# EasyEDA Pro project OhmmeterV1_1.epro

# Schematic Schematic 1

## Sheets
1 Input and Input Protection: Create Date: 2024-03-28; Page Name: Input and Input Protection; Project Name: OhmmeterV1.1_Release; Schematic Name: Schematic 1; Update Date: 2024-03-27; Drawn: Thomas Crisafulli; Page Size: A4
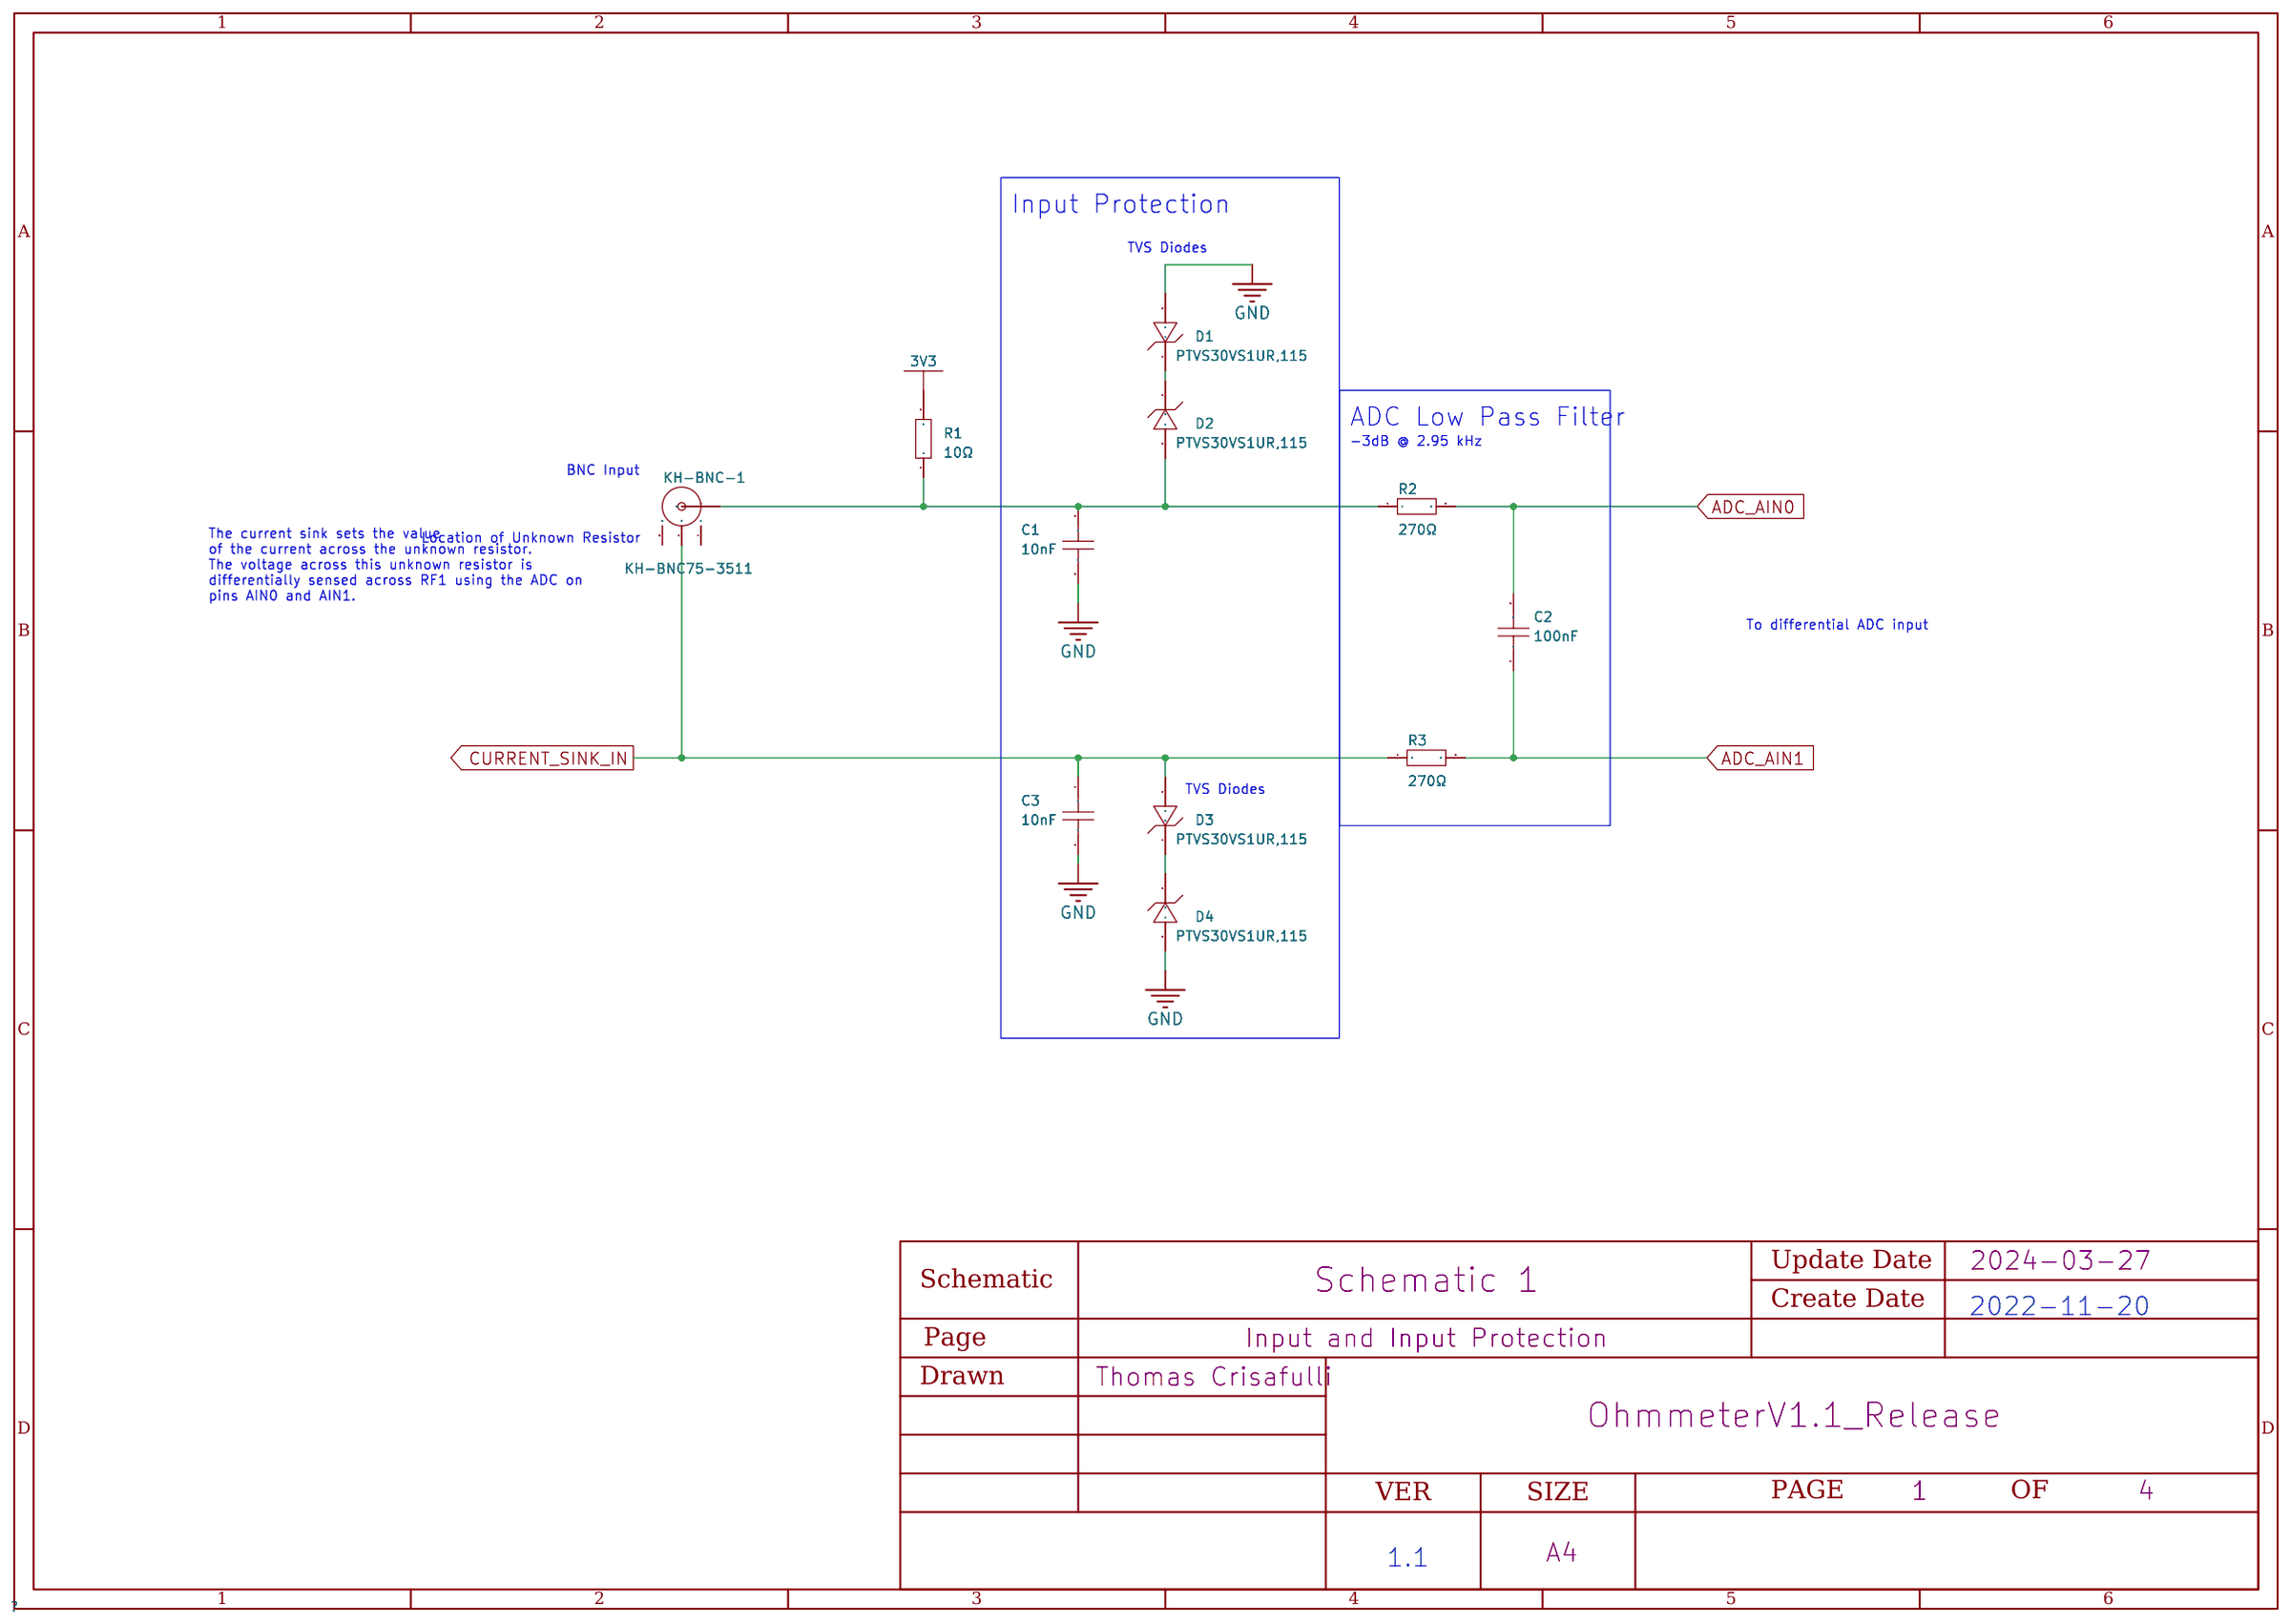
[diagram p0: Input and Input Protection]
2 Digital Circuitry: Page Name: Digital Circuitry; Page Size: A3
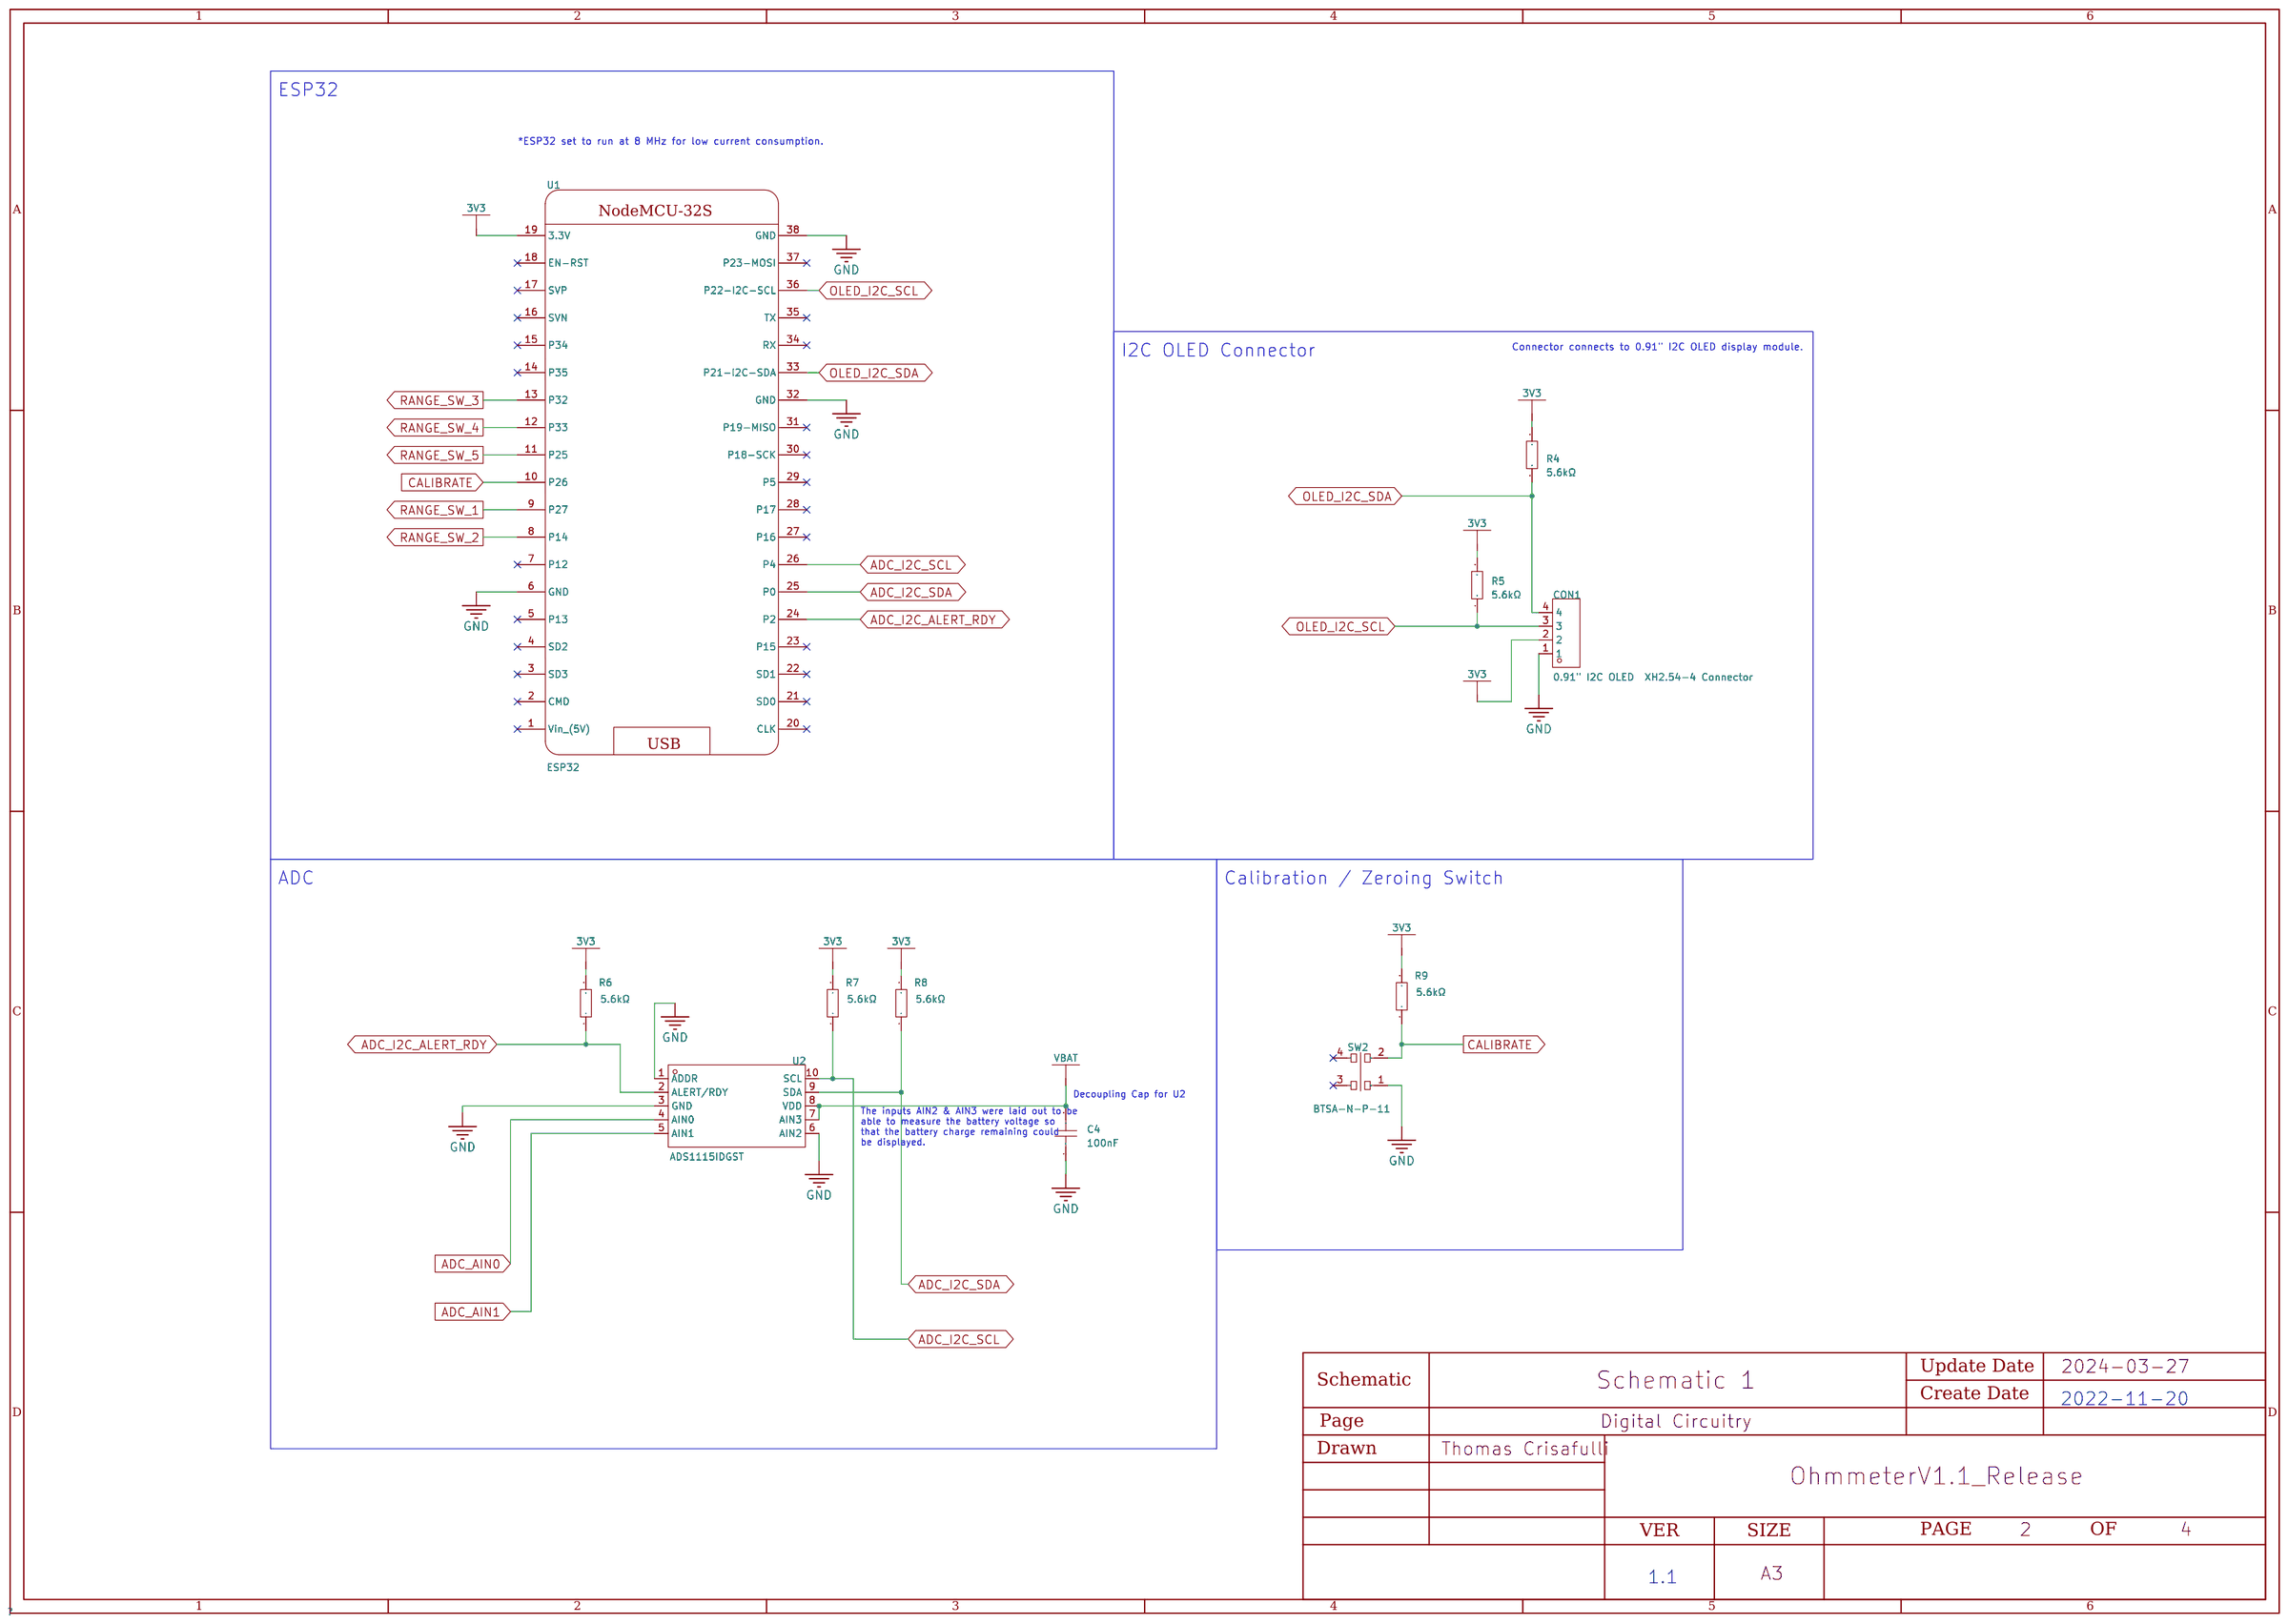
[diagram p1: Digital Circuitry]
3 Current Sink and Ranges: Page Name: Current Sink and Ranges.Schematic 1; Project Name: OhmmeterV3.0_Release; Page Size: A3
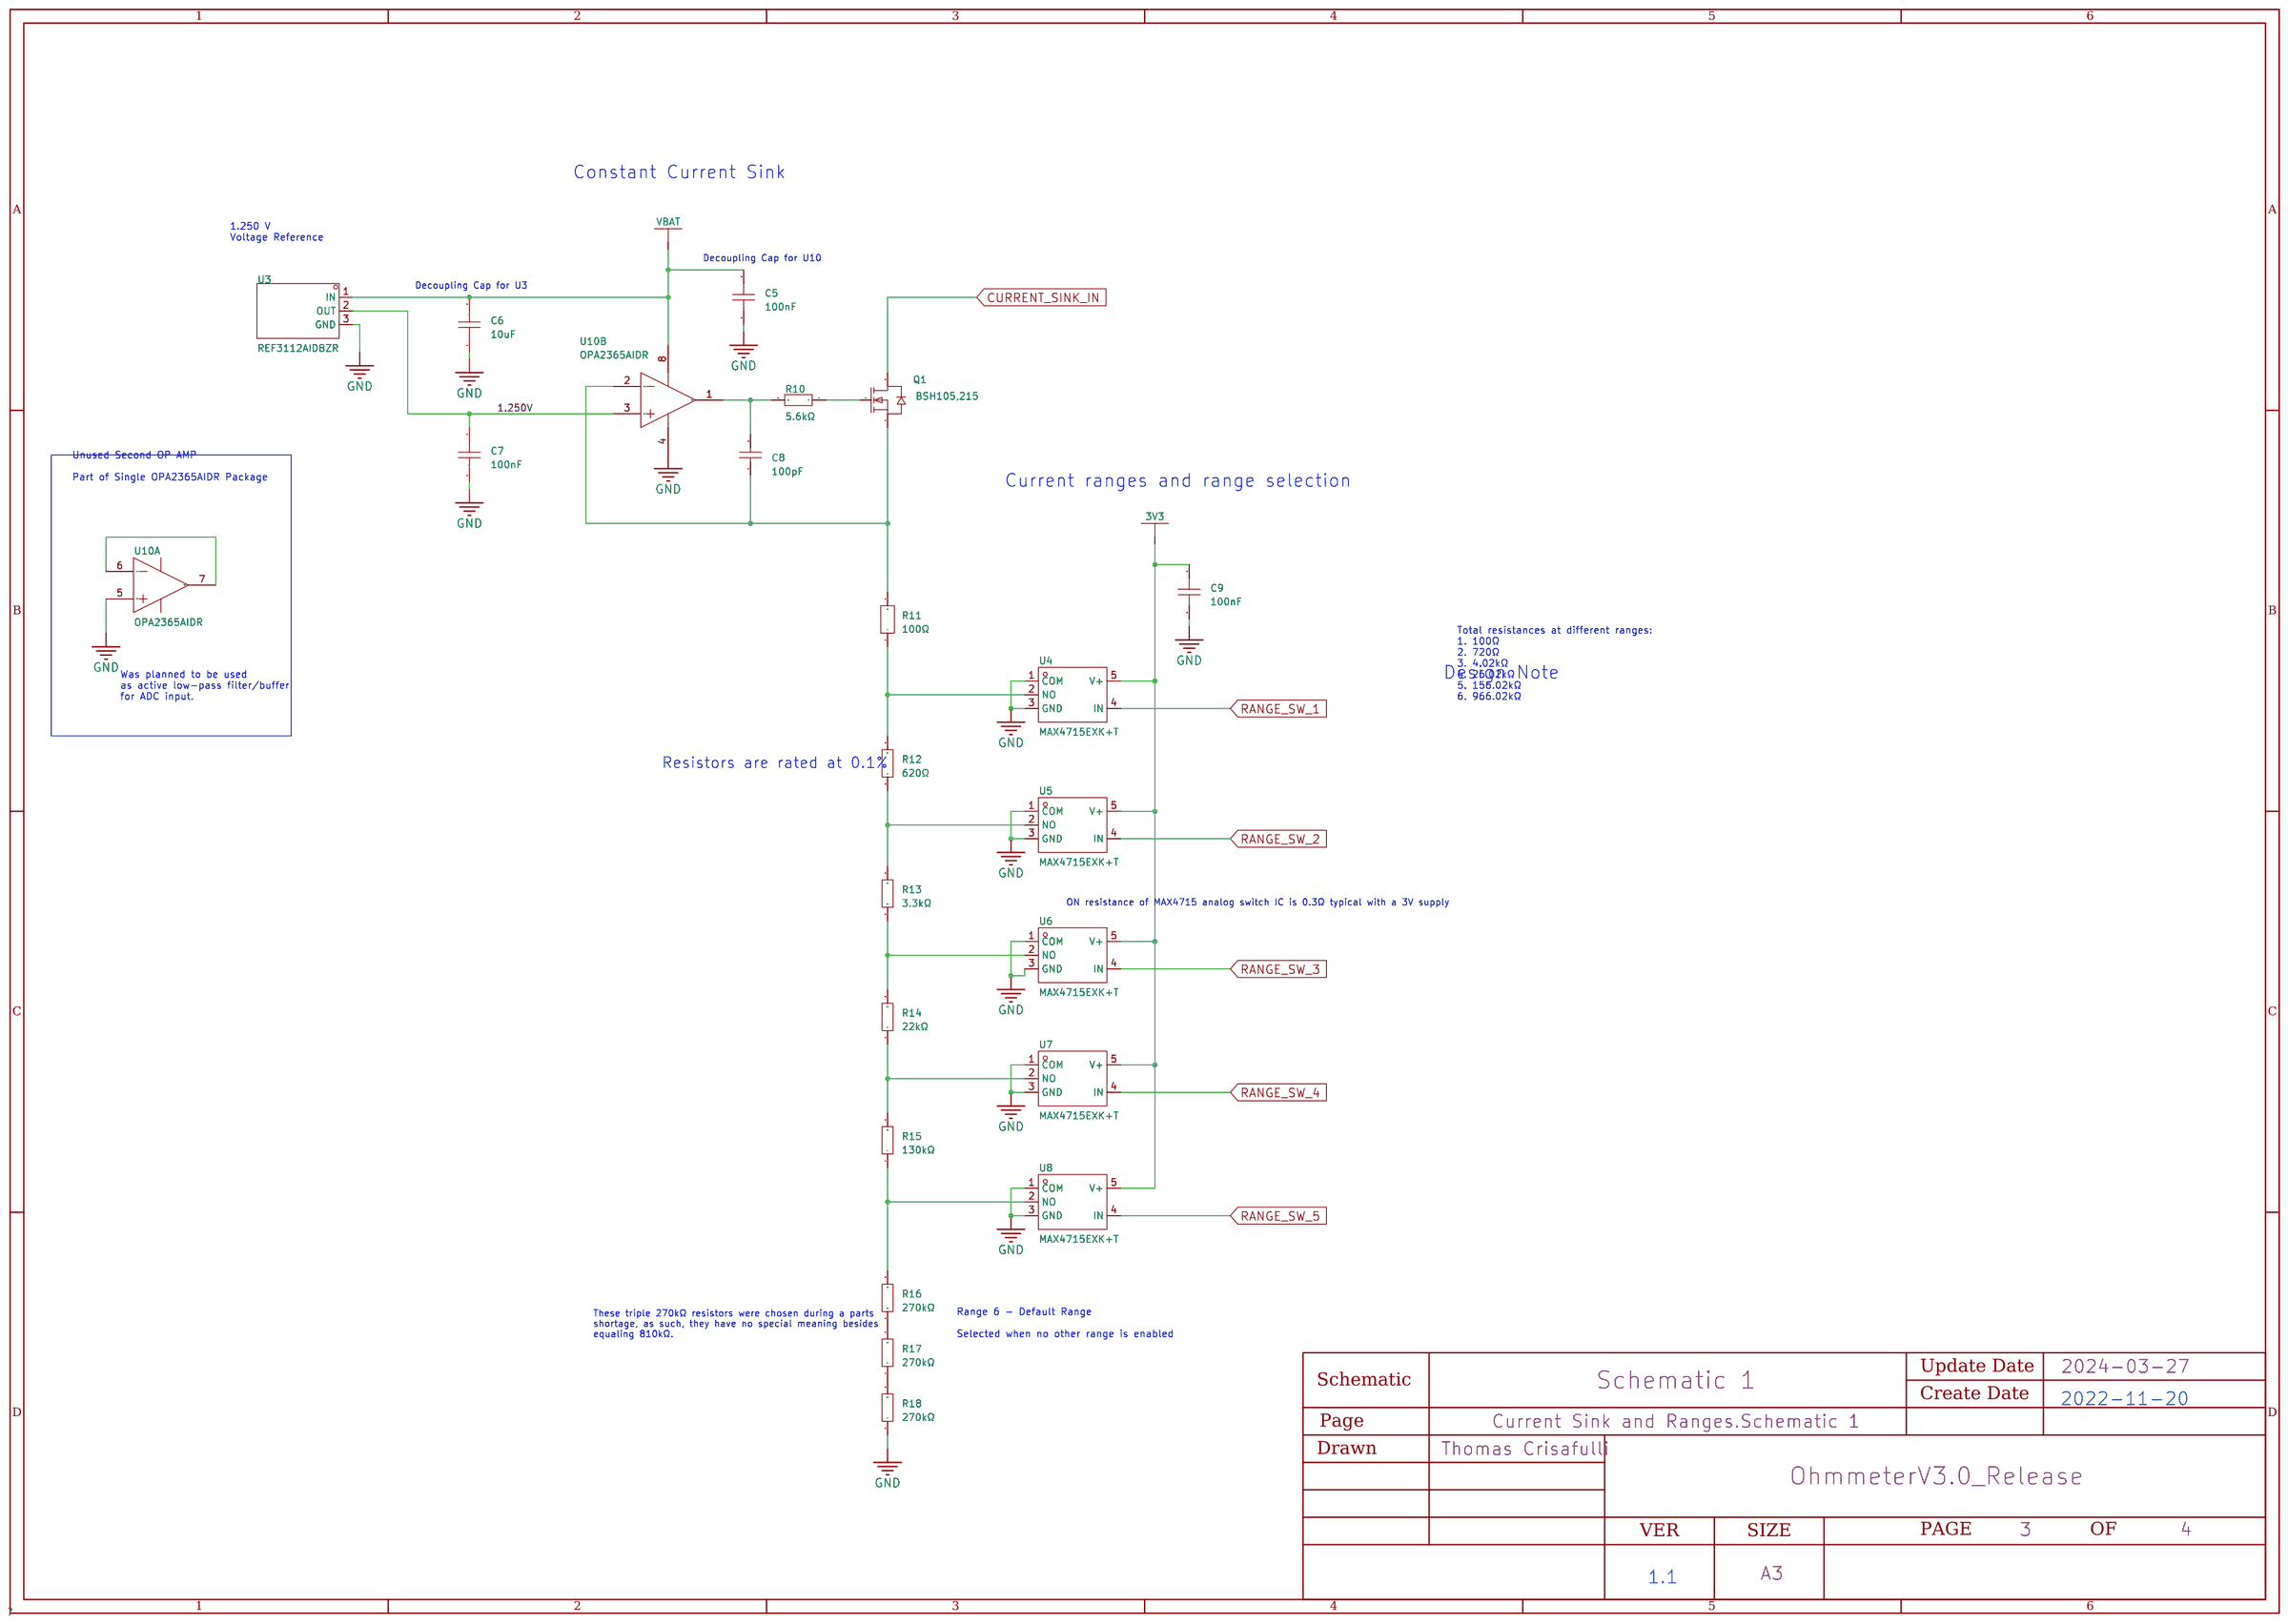
[diagram p2: Current Sink and Ranges]
4 Battery and LDO: Page Name: Battery and LDO; Project Name: OhmmeterV3.0_Release; Schematic Name: schematic
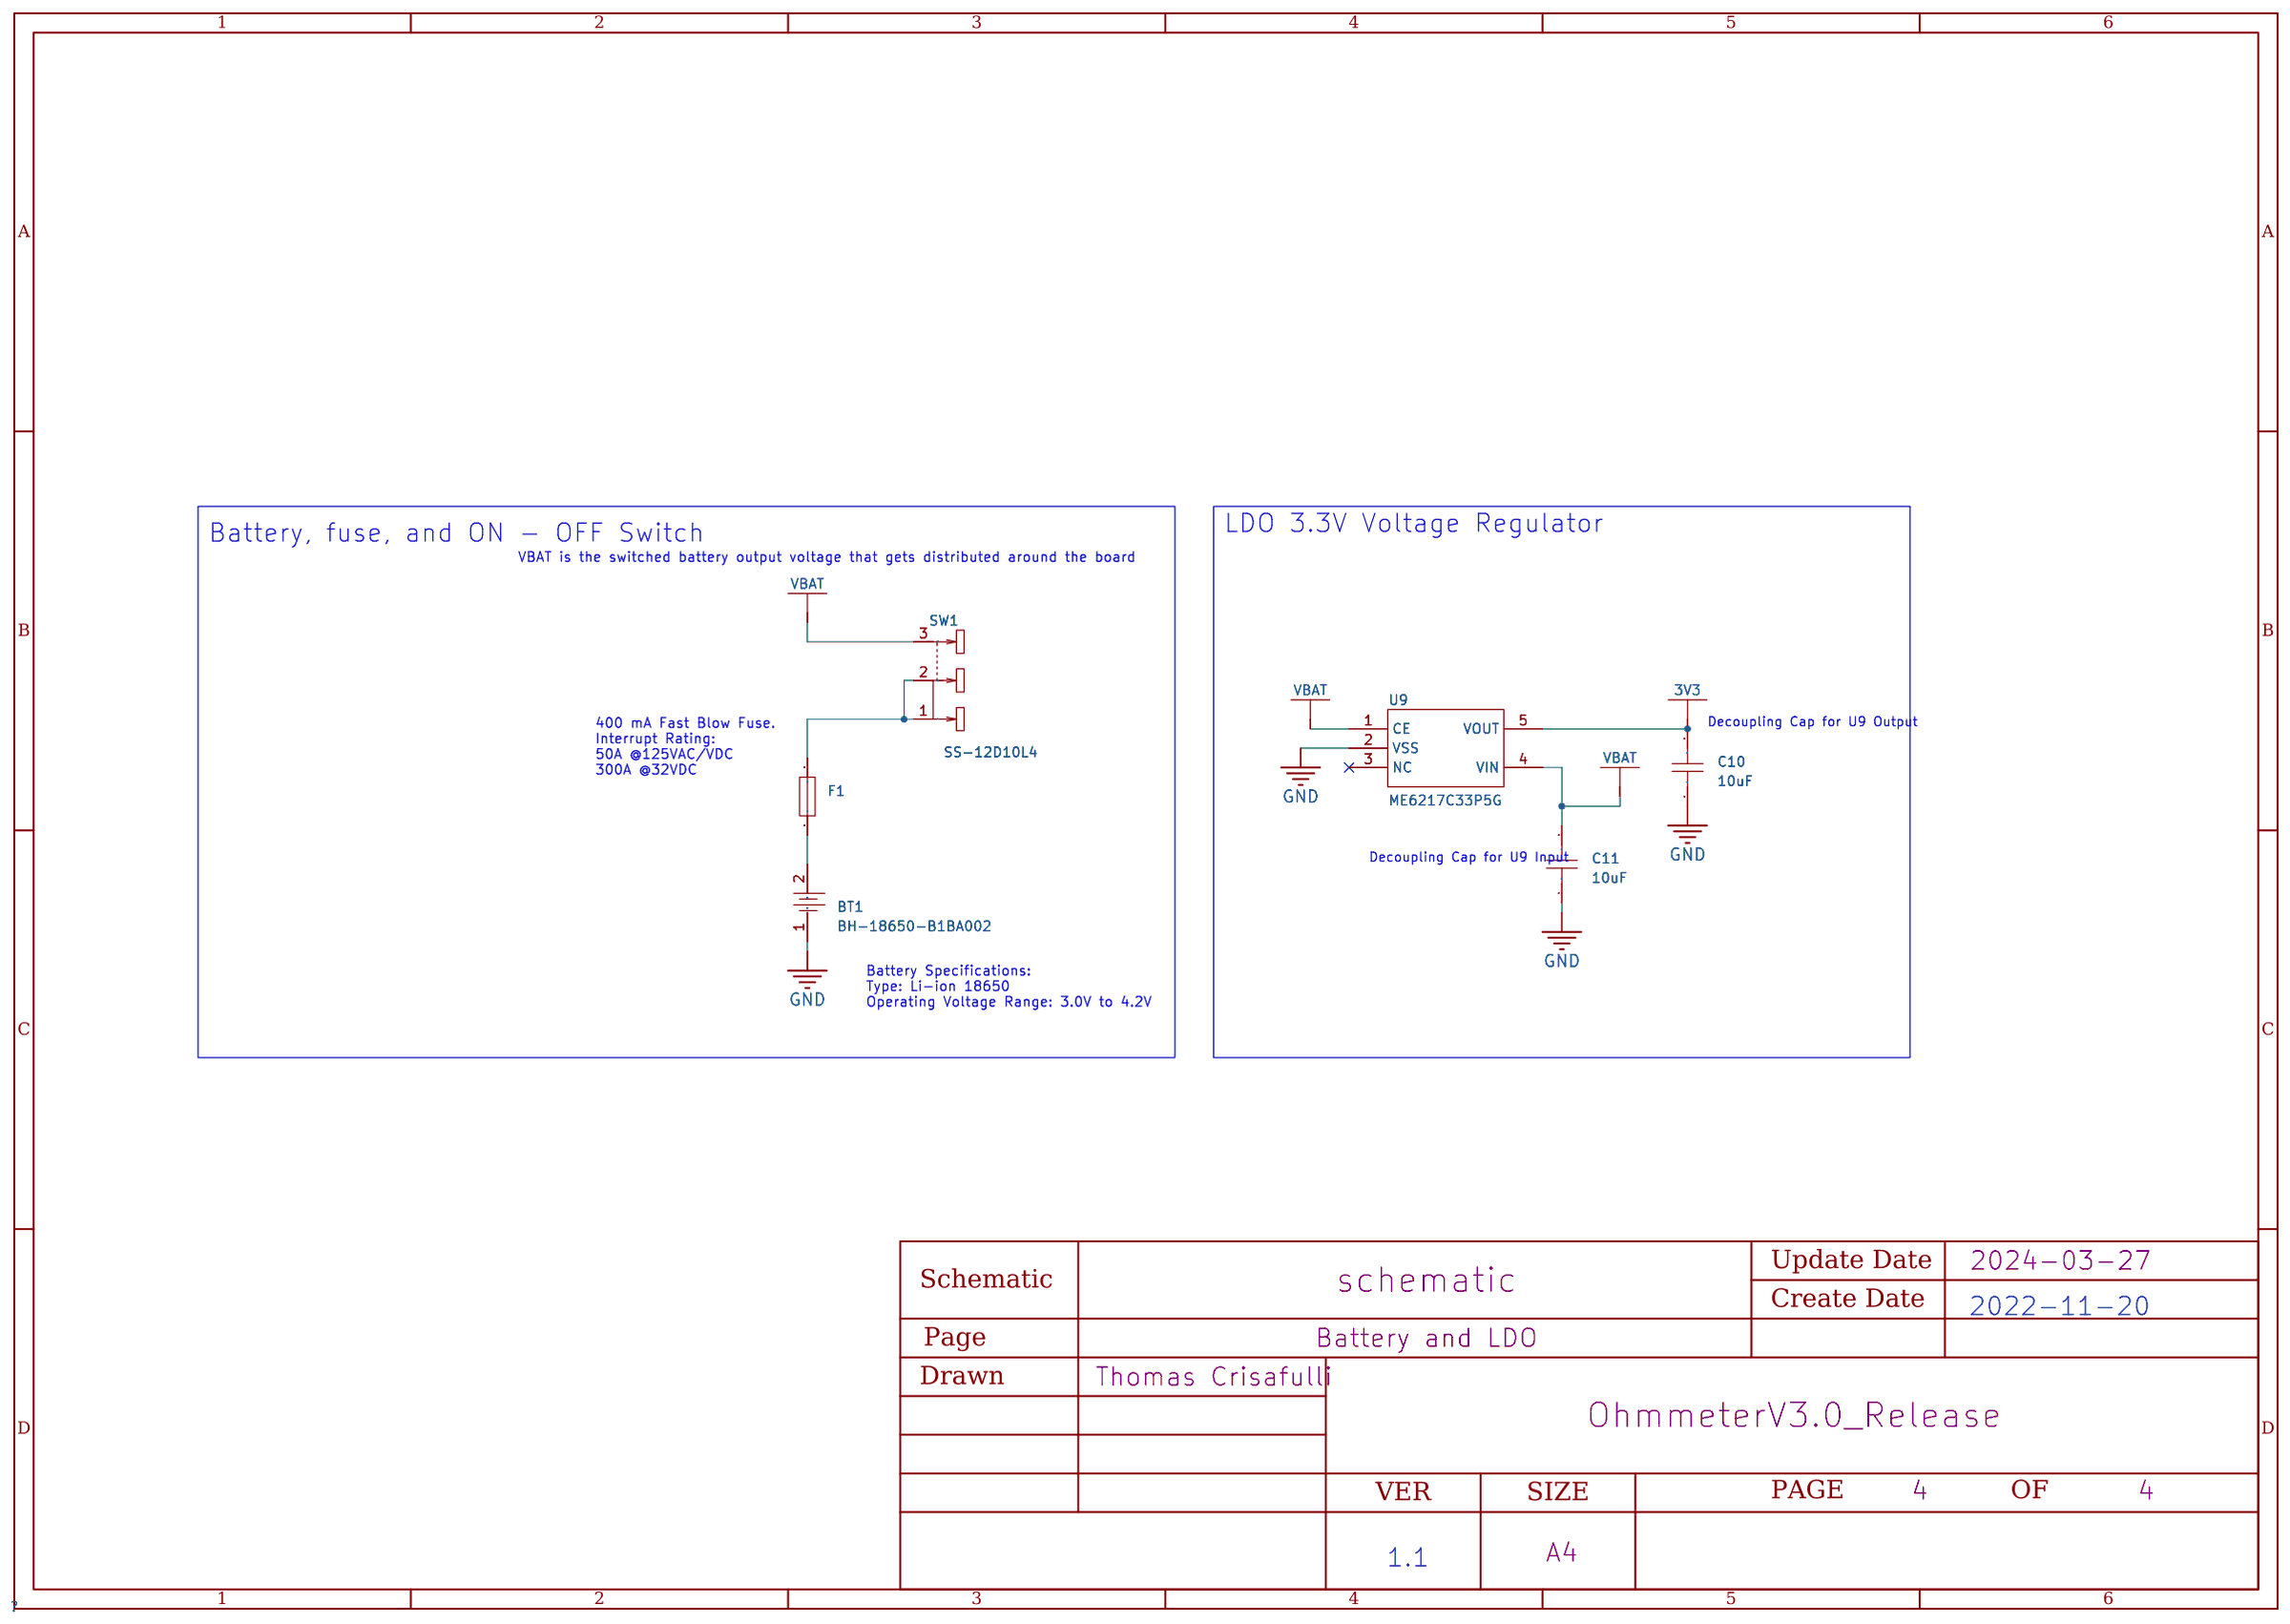
[diagram p3: Battery and LDO]

## Parts
sheet Battery and LDO
BT1  BH-18650-B1BA002  [BATTERY-SMD_18650-1S-L77.1-W20.7-1]
C10  10uF  [C0603]
C11  10uF  [C0603]
F1  -  [0451.400MRL]
SW1  SS-12D10L4  [SW-TH_SS-12D10L3]
U9  ME6217C33P5G  [SOT-89-5_L4.5-W2.5-P1.50-LS4.5-BR]
sheet Current Sink and Ranges
C5  100nF  [C0603]
C6  10uF  [C0603]
C7  100nF  [C0603]
C8  100pF  [C0603]
C9  100nF  [C0603]
Q1  BSH105,215  [TO-236AB_L2.9-W1.3-P0.95-LS2.3-BR]
R10  5.6kΩ  [R0603]
R11  100Ω  [R0805]
R12  620Ω  [R0805]
R13  3.3kΩ  [R0805]
R14  22kΩ  [R0805]
R15  130kΩ  [R0805]
R16  270kΩ  [R0805]
R17  270kΩ  [R0805]
R18  270kΩ  [R0805]
U3  REF3112AIDBZR  [SOT-23-3_L2.9-W1.6-P1.90-LS2.8-BR]
U4  MAX4715EXK+T  [SC-70-5_L2.0-W1.3-P0.65-LS2.1-BR]
U5  MAX4715EXK+T  [SC-70-5_L2.0-W1.3-P0.65-LS2.1-BR]
U6  MAX4715EXK+T  [SC-70-5_L2.0-W1.3-P0.65-LS2.1-BR]
U7  MAX4715EXK+T  [SC-70-5_L2.0-W1.3-P0.65-LS2.1-BR]
U8  MAX4715EXK+T  [SC-70-5_L2.0-W1.3-P0.65-LS2.1-BR]
U10  OPA2365AIDR  [SOIC-8_L4.9-W3.9-P1.27-LS6.0-BL]  (sections 1,2)
sheet Digital Circuitry
C4  100nF  [C0603]
CON1  0.91" I2C OLED  XH2.54-4 Connector  [CONN-TH_XH2.54-4]
R4  5.6kΩ  [R0603]
R5  5.6kΩ  [R0603]
R6  5.6kΩ  [R0603]
R7  5.6kΩ  [R0603]
R8  5.6kΩ  [R0603]
R9  5.6kΩ  [R0603]
SW2  BTSA-N-P-11  [SW-TH_BTSA-X-P-11]
U1  ESP32  [NODEMCU-32SLUA]
U2  ADS1115IDGST  [VSSOP-10_L3.0-W3.0-P0.50-LS4.9-BL]
sheet Input and Input Protection
C1  10nF  [C0603]
C2  100nF  [C0603]
C3  10nF  [C0603]
D1  PTVS30VS1UR,115  [SOD-123_L2.6-W1.7-LS3.5-RD]
D2  PTVS30VS1UR,115  [SOD-123_L2.6-W1.7-LS3.5-RD]
D3  PTVS30VS1UR,115  [SOD-123_L2.6-W1.7-LS3.5-RD]
D4  PTVS30VS1UR,115  [SOD-123_L2.6-W1.7-LS3.5-RD]
KH-BNC-1  KH-BNC75-3511  [ANT-TH_KH-BNC75-3511]
R1  10Ω  [R0603]
R2  270Ω  [R0603]
R3  270Ω  [R0603]

## Library data of the parts
BT1 = BH-18650-B1BA002: LCSC Part Name: 电池盒BH-18650; Supplier Part: C2988620; Manufacturer: MYOUNG(美阳); Supplier Footprint: SMD; JLCPCB Part Class: Extended Part; Datasheet: https://atta.szlcsc.com/upload/public/pdf/source/20220402/870DB99AB50CA0DF8D51CF7C86A51FAB.pdf; Supplier: LCSC
C6 C10 C11 = CL10A106KP8NNNC: Capacitance: Tolerance:±10% Tolerance:±10% Voltage Rated: Temperature Coefficient:; LCSC Part Name: 10uF ±10% 10V; Supplier Part: C19702; Manufacturer: SAMSUNG(三星); Supplier Footprint: 0603; JLCPCB Part Class: Basic Part; Datasheet: https://atta.szlcsc.com/upload/public/pdf/source/20160103/1457707703378.pdf; Supplier: LCSC; Tolerance: ±10%
F1 = 0451.400MRL: 400 mA Fast Blow Fuse. Interrupt Rating: 50A @125VAC/VDC 300A @32VDC
SW1 = SS-12D10L4: Current Rating (DC):3A Voltage Rating (DC):125V Current Rating (AC):3A Voltage Rating (AC):125V Circuit:SPDT Mounting Style:Straight Mechanical Life:10000 Actuator Color:Black Actuator Style:Rectangular columnar Pin Style:PCPin Operating Temperature:-40~; LCSC Part Name: 插件大电流拨动开关 黑色平柄SS-12D10L4; Supplier Part: C843364; Manufacturer: XKB Connectivity(中国星坤); Supplier Footprint: 插件; JLCPCB Part Class: Extended Part; Datasheet: https://atta.szlcsc.com/upload/public/pdf/source/20211009/D6412F37AABE6F9459A6EE7FA4DAEADB.pdf; Supplier: LCSC; Current Rating (DC): 3A; Voltage Rating (DC): 125V; Current Rating (AC): 3A; Voltage Rating (AC): 125V; Circuit: SPDT; Mounting Style: Straight; Mechanical Life: 10000; Actuator Color: Black; Actuator Style: Rectangular columnar; Pin Style: PCPin; Operating Temperature: -40~+85; Switch Length: 13mm; Switch Width: 6.8mm; Switch Height: 6.4mm
U9 = ME6217C33P5G: Output Type: Output Polarity:Positive Number of Outputs:1 Maximum Input Voltage:6.5V Output Voltage:3.3V~3.3V Output Voltage:3.3V~3.3V Dropout Voltage:180mV@(300mA) Output Current:800mA Power Supply Rejection Ratio (PRSS):65dB@(1kHz); LCSC Part Name: Vin=6.5V Vout=3.3V 800mA 65dB@(1kHz); Supplier Part: C81592; Manufacturer: MICRONE(南京微盟); Supplier Footprint: SOT-89-5; JLCPCB Part Class: Extended Part; Datasheet: https://atta.szlcsc.com/upload/public/pdf/source/20170919/C81592_1505787400735977273.pdf; Supplier: LCSC; Output Polarity: Positive; Number of Outputs: 1; Maximum Input Voltage: 6.5V; Output Voltage: 3.3V~3.3V; Dropout Voltage: 180mV@(300mA); Output Current: 800mA; Power Supply Rejection Ratio (PRSS): 65dB@(1kHz)
C2 C4 C5 C7 C9 = CC0603KRX7R9BB104: Capacitance: Tolerance:±10% Tolerance:±10% Voltage Rated: Temperature Coefficient:; LCSC Part Name: 100nF ±10% 50V; Supplier Part: C14663; Manufacturer: YAGEO(国巨); Supplier Footprint: 0603; JLCPCB Part Class: Basic Part; Datasheet: https://atta.szlcsc.com/upload/public/pdf/source/20170116/1484561234239.pdf; Supplier: LCSC; Tolerance: ±10%
C8 = 0603CG101F500NT: Capacitance: Tolerance:±1% Tolerance:±1% Voltage Rated: Temperature Coefficient:; LCSC Part Name: 100pF ±1% 50V; Supplier Part: C55722; Manufacturer: FH(风华); Supplier Footprint: 0603; JLCPCB Part Class: Extended Part; Datasheet: https://atta.szlcsc.com/upload/public/pdf/source/20170923/C55722_1506149491504988838.pdf; Supplier: LCSC; Tolerance: ±1%
Q1 = BSH105,215: Type: Drain Source Voltage (Vdss): Continuous Drain Current (Id): Power Dissipation (Pd): Drain Source On Resistance (RDS(on)@Vgs,Id):200mΩ@4.5V,600mA Gate Threshold Voltage (Vgs(th)@Id):570mV@1mA; LCSC Part Name: N沟道 20V 1.05A; Supplier Part: C478010; Manufacturer: Nexperia(安世); Supplier Footprint: TO-236AB; JLCPCB Part Class: Extended Part; Datasheet: https://atta.szlcsc.com/upload/public/pdf/source/20200102/C478010_E6AC30BA7E41EA0C1C4E682856045296.pdf; Supplier: LCSC; Drain Source On Resistance (RDS(on)@Vgs,Id): 200mΩ@4.5V,600mA; Gate Threshold Voltage (Vgs(th)@Id): 570mV@1mA
R4-R10 = RMC06035.6K1%N: Resistance:5.6kΩ Tolerance:±1% Power(Watts):0.1W; LCSC Part Name: 5.6KΩ ±1%; Supplier Part: C325717; Manufacturer: Tyohm(幸亚电阻); Supplier Footprint: 0603; JLCPCB Part Class: Extended Part; Datasheet: https://atta.szlcsc.com/upload/public/pdf/source/20190115/C325717_00CC223FA0A7351D36013C012E297DA3.pdf; Supplier: LCSC; Tolerance: ±1%; Power(Watts): 0.1W
R11 = RT0805BRB07100RL: Type:Thin Film Resistor Resistance: Tolerance:±0.1% Tolerance:±0.1% Power(Watts): Temperature Coefficient:±10ppm/ Temperature Coefficient:±10ppm/ Overload Voltage (Max): Operating Temperature Range:-55~+155 Operating Temperature Range:-55~+155; LCSC Part Name: 100Ω ±0.1% 125mW; Supplier Part: C706199; Manufacturer: YAGEO(国巨); Supplier Footprint: 0805; JLCPCB Part Class: Extended Part; Datasheet: https://atta.szlcsc.com/upload/public/pdf/source/20200720/C706199_F8B0308A35FC487A6D0BBE73ED768472.pdf; Supplier: LCSC; Type: Thin Film Resistor; Tolerance: ±0.1%; Temperature Coefficient: ±10ppm/; Operating Temperature Range: -55~+155
R12 = PTFR0805B620RN9: Type:Thin Film Resistor Resistance: Tolerance:±0.1% Tolerance:±0.1% Power(Watts): Temperature Coefficient:±10ppm/ Temperature Coefficient:±10ppm/ Overload Voltage (Max): Operating Temperature Range:-55~+125 Operating Temperature Range:-55~+125; LCSC Part Name: 620Ω ±0.1% 130mW; Supplier Part: C351557; Manufacturer: RESI(开步睿思）; Supplier Footprint: 0805; JLCPCB Part Class: Extended Part; Datasheet: https://atta.szlcsc.com/upload/public/pdf/source/20200421/C328426_1F8A6F869BB4A34F9E140D3E05CCCC70.pdf; Supplier: LCSC; Type: Thin Film Resistor; Tolerance: ±0.1%; Temperature Coefficient: ±10ppm/; Operating Temperature Range: -55~+125
R13 = PTFR0805B3K30N9: Type:Thin Film Resistor Resistance: Tolerance:±0.1% Tolerance:±0.1% Power(Watts): Temperature Coefficient:±10ppm/ Temperature Coefficient:±10ppm/ Overload Voltage (Max): Operating Temperature Range:-55~+125 Operating Temperature Range:-55~+125; LCSC Part Name: 3.3kΩ ±0.1% 130mW; Supplier Part: C351569; Manufacturer: RESI(开步睿思）; Supplier Footprint: 0805; JLCPCB Part Class: Extended Part; Datasheet: https://atta.szlcsc.com/upload/public/pdf/source/20200421/C328426_1F8A6F869BB4A34F9E140D3E05CCCC70.pdf; Supplier: LCSC; Type: Thin Film Resistor; Tolerance: ±0.1%; Temperature Coefficient: ±10ppm/; Operating Temperature Range: -55~+125
R14 = PTFR0805B22K0N9: Type:Thin Film Resistor Resistance: Tolerance:±0.1% Tolerance:±0.1% Power(Watts): Temperature Coefficient:±10ppm/ Temperature Coefficient:±10ppm/ Overload Voltage (Max): Operating Temperature Range:-55~+125 Operating Temperature Range:-55~+125; LCSC Part Name: 22kΩ ±0.1% 130mW; Supplier Part: C351592; Manufacturer: RESI(开步睿思）; Supplier Footprint: 0805; JLCPCB Part Class: Extended Part; Datasheet: https://atta.szlcsc.com/upload/public/pdf/source/20200421/C328426_1F8A6F869BB4A34F9E140D3E05CCCC70.pdf; Supplier: LCSC; Type: Thin Film Resistor; Tolerance: ±0.1%; Temperature Coefficient: ±10ppm/; Operating Temperature Range: -55~+125
R15 = PTFR0805B130KN9: Type:Thin Film Resistor Resistance: Tolerance:±0.1% Tolerance:±0.1% Power(Watts): Temperature Coefficient:±10ppm/ Temperature Coefficient:±10ppm/ Overload Voltage (Max): Operating Temperature Range:-55~+125 Operating Temperature Range:-55~+125; LCSC Part Name: 130kΩ ±0.1% 130mW; Supplier Part: C351613; Manufacturer: RESI(开步睿思）; Supplier Footprint: 0805; JLCPCB Part Class: Extended Part; Datasheet: https://atta.szlcsc.com/upload/public/pdf/source/20200421/C328426_1F8A6F869BB4A34F9E140D3E05CCCC70.pdf; Supplier: LCSC; Type: Thin Film Resistor; Tolerance: ±0.1%; Temperature Coefficient: ±10ppm/; Operating Temperature Range: -55~+125
R16-R18 = PTFR0805B270KN9: Type:Thin Film Resistor Resistance: Tolerance:±0.1% Tolerance:±0.1% Power(Watts): Temperature Coefficient:±10ppm/ Temperature Coefficient:±10ppm/ Overload Voltage (Max): Operating Temperature Range:-55~+125 Operating Temperature Range:-55~+125; LCSC Part Name: 270kΩ ±0.1% 130mW; Supplier Part: C351588; Manufacturer: RESI(开步睿思）; Supplier Footprint: 0805; JLCPCB Part Class: Extended Part; Datasheet: https://atta.szlcsc.com/upload/public/pdf/source/20200421/C328426_1F8A6F869BB4A34F9E140D3E05CCCC70.pdf; Supplier: LCSC; Type: Thin Film Resistor; Tolerance: ±0.1%; Temperature Coefficient: ±10ppm/; Operating Temperature Range: -55~+125
U3 = REF3112AIDBZR: Reference Type:series connection Output Type:Fixed Input Voltage:1.8V~5.5V Input Voltage:1.8V~5.5V Output Current:10mA Tolerance:±0.2% Tolerance:±0.2% Temperature Coefficient:20ppm/ Supply Current:135uA Noise - 1/10Hz to 10Hz:17uVp-p Noise - 10Hz to 10kH; LCSC Part Name: 串联 10mA; Supplier Part: C74223; Manufacturer: TI(德州仪器); Supplier Footprint: SOT-23(SOT-23-3); JLCPCB Part Class: Extended Part; Datasheet: https://atta.szlcsc.com/upload/public/pdf/source/20180326/C74223_A49D4B7B40A1FCF0C88241B13A13CC28.pdf; Supplier: LCSC; Reference Type: series connection; Output Type: Fixed; Input Voltage: 1.8V~5.5V; Output Current: 10mA; Tolerance: ±0.2%; Temperature Coefficient: 20ppm/; Supply Current: 135uA; Noise - 1/10Hz to 10Hz: 17uVp-p; Noise - 10Hz to 10kHz: 24uVrms; Operating Temperature: -40~+125@(Ta)
U4-U8 = MAX4715EXK+T: Switch Circuit:- Multiplexer/Demultiplexer Circuit:- Number of Circuits:- On Resistance (Max):- Switch Voltage (Max):- On Time (Max):- Off Time (Max):- Supply Voltage:- Operating Temperature:-; Supplier Part: C2651930; Manufacturer: MAXIM(美信); Supplier Footprint: SC-70-5; JLCPCB Part Class: Extended Part; Datasheet: https://atta.szlcsc.comnull; Supplier: LCSC
U10 = OPA2365AIDR: Amplifier Type:High-speedbroadbandamplifier Number of Circuits: -3db Bandwidth（G=1）:- Current - Input Bias（Ib）:0.2pA Voltage - Input Offset（Vos）:100uV Gain Bandwidth Product（GBP）: Slew Rate（SR）: Output Type:Rail-to-Rail Supply Voltage（Single）: Iq per chan; Supplier Part: C130011; Manufacturer: TI(德州仪器); Supplier Footprint: SOIC-8_150mil; JLCPCB Part Class: Extended Part; Datasheet: https://atta.szlcsc.com/upload/public/pdf/source/20170918/C130011_1505703251368975095.pdf; Supplier: LCSC; Amplifier Type: High-speedbroadbandamplifier; Current - Input Bias（Ib）: 0.2pA; Voltage - Input Offset（Vos）: 100uV; Output Type: Rail-to-Rail
CON1 = XH2.54-4_C9900012082: LCSC Part Name: XH2.54-4; Supplier Part: C9900012082; Supplier Footprint: Header4; JLCPCB Part Class: Extended Part; Datasheet: https://atta.szlcsc.comnull; Supplier: LCSC
SW2 = BTSA-N-P-11: Contact Current:100mA Voltage Rating (AC):- Voltage Rating (DC):- Insulation Resistance:100MΩ Circuit:- Mounting Style:Straight Self Lock / No Lock:No lock Actuator Style:Square Plunger Actuator/Cap Color:Blue With Lamp:No Pin Style:PCPin Operating Force:; Supplier Part: C2888323; Manufacturer: ROCPU Switches(台普); Supplier Footprint: 插件; JLCPCB Part Class: Extended Part; Datasheet: https://atta.szlcsc.com/upload/public/pdf/source/20210914/4FB41C6B2F934BE864C4B13707F31A70.pdf; Supplier: LCSC; Contact Current: 100mA; Insulation Resistance: 100MΩ; Mounting Style: Straight; Self Lock / No Lock: No lock; Actuator Style: Square Plunger; Actuator/Cap Color: Blue; With Lamp: No; Pin Style: PCPin; Operating Force: 250gf@±50gf; Operating Temperature: -20~+70; Mechanical Life: 10000
U1 = ESP32: Supplier: LCSC; Supplier Part: C111436; Manufacturer: Ai-Thinker; Manufacturer Part: NodeMCU-32SLua; link: https://lcsc.com/product-detail/Modules_NodeMCU-32S-Lua_C111436.html
U2 = ADS1115IDGST: Number of Bits:- Sampling Rate (Per Second): Number of Inputs: Input Type: Data Interface: Voltage - Supply: Reference Type:; Supplier Part: C468683; Manufacturer: TI(德州仪器); Supplier Footprint: VSSOP-10; JLCPCB Part Class: Extended Part; Datasheet: https://atta.szlcsc.com/upload/public/pdf/source/20200108/C468683_F8EABDE88EC9D3B6CCD5339FC0AB3BAE.pdf; Supplier: LCSC
C1 C3 = 06031C103K4T2A: Capacitance: Tolerance:±10% Tolerance:±10% Voltage Rated: Temperature Coefficient:; LCSC Part Name: 10nF ±10% 100V; Supplier Part: C597087; Manufacturer: Kyocera AVX; Supplier Footprint: 0603; JLCPCB Part Class: Extended Part; Datasheet: https://atta.szlcsc.com/upload/public/pdf/source/20200611/C596996_5C2870FCBE04273D0B42880C13DA8C38.pdf; Supplier: LCSC; Tolerance: ±10%
D1-D4 = PTVS30VS1UR,115: Polarity:- Reverse Stand-Off Voltage (Vrwm):30V Breakdown Voltage (Min):33.3V Breakdown Voltage (Max):36.8V Reverse Leakage Current (Ir):0.1uA Peak Pulse Current (Ipp)@10/1000s:- Maximum Clamping Voltage:48.4V Peak Pulse Power Dissipation (Ppp)@10/1000s; LCSC Part Name: Vrwm:30V 400W; Supplier Part: C553410; Manufacturer: Nexperia(安世); Supplier Footprint: SOD-123W; JLCPCB Part Class: Extended Part; Datasheet: https://atta.szlcsc.com/upload/public/pdf/source/20200102/C478011_F05D9968189F983388C839BB3EF367D6.pdf; Supplier: LCSC; Reverse Stand-Off Voltage (Vrwm): 30V; Breakdown Voltage (Min): 33.3V; Breakdown Voltage (Max): 36.8V; Reverse Leakage Current (Ir): 0.1uA; Maximum Clamping Voltage: 48.4V; Peak Pulse Power Dissipation (Ppp)@10/1000μs: 400W
KH-BNC-1 = KH-BNC75-3511: Connector Type:板端 RF Series:BNC Interface Type:内孔 Number of Ports:1 Impedance:75Ω Frequency-Max:3GHz Style:弯头 Interface Diameter:9.5mm Interface Length/Height:- Operating Temperature Range:-55~+155 Operating Temperature Range:-55~+155; LCSC Part Name: BNC 内孔 弯头; Supplier Part: C2837588; Manufacturer: kinghelm(金航标); Supplier Footprint: 插件; JLCPCB Part Class: Extended Part; Datasheet: https://atta.szlcsc.com/upload/public/pdf/source/20221123/107886A8942993FCB0C00E519661A2AA.pdf; Supplier: LCSC; Connector Type: 板端; RF Series: BNC; Interface Type: 内孔; Number of Ports: 1; Impedance: 75Ω; Frequency-Max: 3GHz; Style: 弯头; Interface Diameter: 9.5mm; Operating Temperature Range: -55~+155
R1 = AC0603FR-0710RL: Type:Thick Film Resistors Resistance: Tolerance:±1% Tolerance:±1% Power(Watts): Overload Voltage (Max): Temperature Coefficient:±200ppm/℃ Temperature Coefficient:±200ppm/℃ Operating Temperature Range:-55℃~+155℃ Operating Temperature Range:-55℃~+155℃; LCSC Part Name: 厚膜电阻 10Ω ±1% 100mW; Supplier Part: C138286; Manufacturer: YAGEO(国巨); Supplier Footprint: 0603; JLCPCB Part Class: Extended Part; Datasheet: https://atta.szlcsc.com/upload/public/pdf/source/20180927/C229861_4ABDC471507C1ED6AFB4BA66AFC8620A.pdf; Supplier: LCSC; Type: Thick Film Resistors; Tolerance: ±1%; Temperature Coefficient: ±200ppm/℃; Operating Temperature Range: -55℃~+155℃
R2 R3 = RS-03K2700FT: Resistance: Tolerance:±1% Tolerance:±1% Power(Watts): Temperature Coefficient:±100ppm/ Temperature Coefficient:±100ppm/ Overload Voltage (Max): Operating Temperature Range:-55~+155 Operating Temperature Range:-55~+155; LCSC Part Name: 270Ω ±1% 100mW; Supplier Part: C286581; Manufacturer: FH(风华); Supplier Footprint: 0603; JLCPCB Part Class: Extended Part; Datasheet: https://atta.szlcsc.com/upload/public/pdf/source/20180927/C286581_BEC7BD5AD7941FF51850C451D7F33E21.pdf; Supplier: LCSC; Tolerance: ±1%; Temperature Coefficient: ±100ppm/; Operating Temperature Range: -55~+155

## Nets
1.250V: C7.1 U3.2(OUT) U10.3(IN A+)
3V3: C9.2 C10.2 CON1.2 R1.2 R4.1 R5.2 R6.2 R7.2 R8.2 R9.2 U1.19(3.3V) U4.5(V+) U5.5(V+) U6.5(V+) U7.5(V+) U8.5(V+) U9.5(VOUT)
GND: BT1.1 C1.2 C3.2 C4.1 C5.1 C6.1 C7.2 C9.1 C10.1 C11.1 CON1.1 D1.2(A) D4.2(A) R18.1 SW2.1 U1.6(GND) U1.32(GND) U1.38(GND) U2.1(ADDR) U2.3(GND) U2.6(AIN2) U3.3(GND) U4.1(COM) U4.3(GND) U5.1(COM) U5.3(GND) U6.1(COM) U6.3(GND) U7.1(COM) U7.3(GND) U8.1(COM) U8.3(GND) U9.2(VSS) U10.4(V-) U10.5(IN B+)
VBAT: C4.2 C5.2 C6.2 C11.2 SW1.3 U2.7(AIN3) U2.8(VDD) U3.1(IN) U9.1(CE) U9.4(VIN) U10.8(V+)
ADC_AIN0: C2.2 R2.2 U2.4(AIN0)
ADC_AIN1: C2.1 R3.2 U2.5(AIN1)
ADC_I2C_ALERT_RDY: R6.1 U1.24(P2) U2.2(ALERT/RDY)
ADC_I2C_SCL: R7.1 U1.26(P4) U2.10(SCL)
ADC_I2C_SDA: R8.1 U1.25(P0) U2.9(SDA)
CALIBRATE: R9.1 SW2.2 U1.10(P26)
CURRENT_SINK_IN: C3.1 D3.2(A) KH-BNC-1.2 Q1.3(D) R3.1
OLED_I2C_SCL: CON1.3 R5.1 U1.36(P22-I2C-SCL)
OLED_I2C_SDA: CON1.4 R4.2 U1.33(P21-I2C-SDA)
RANGE_SW_1: U1.9(P27) U4.4(IN)
RANGE_SW_2: U1.8(P14) U5.4(IN)
RANGE_SW_3: U1.13(P32) U6.4(IN)
RANGE_SW_4: U1.12(P33) U7.4(IN)
RANGE_SW_5: U1.11(P25) U8.4(IN)
$1N34949: D1.1(C) D2.1(C)
$1N40044: D3.1(C) D4.1(C)
$1N64285: C1.1 D2.2(A) KH-BNC-1.1(OUT) R1.1 R2.1
$4N526: Q1.1(G) R10.1
$4N529: C8.1 R10.2 U10.1(VOUT A)
$4N533: U10.6(IN B-) U10.7(VOUT B)
$4N538: C8.2 Q1.2(S) R11.2 U10.2(IN A-)
$4N2969: R16.1 R17.2
$4N2970: R17.1 R18.2
$4N2972: R15.1 R16.2 U8.2(NO)
$4N2973: R13.1 R14.2 U6.2(NO)
$4N2979: R14.1 R15.2 U7.2(NO)
$4N2983: R12.1 R13.2 U5.2(NO)
$4N3047: R11.1 R12.2 U4.2(NO)
$6N1642: BT1.2 F1.1
$6N1643: F1.2 SW1.1 SW1.2

Not connected (* = marked no-connect by the designer): KH-BNC-1 3 4; SW2 3* 4*; U1 1(Vin (5V))* 2(CMD)* 3(SD3)* 4(SD2)* 5(P13)* 7(P12)* 14(P35)* 15(P34)* 16(SVN)* 17(SVP)* 18(EN-RST)* 20(CLK)* 21(SD0)* 22(SD1)* 23(P15)* 27(P16)* 28(P17)* 29(P5)* 30(P18-SCK)* 31(P19-MISO)* 34(RX)* 35(TX)* 37(P23-MOSI)*; U9 3(NC)*

## Notes on the sheets
sheet 1
- Input Protection
- TVS Diodes
- ADC Low Pass Filter
- -3dB @ 2.95 kHz
- BNC Input
- Location of Unknown Resistor
- The current sink sets the value
  of the current across the unknown resistor.
  The voltage across this unknown resistor is
  differentially sensed across RF1 using the ADC on
  pins AIN0 and AIN1.
- To differential ADC input
- TVS Diodes
sheet 2
- ESP32
- *ESP32 set to run at 8 MHz for low current consumption.
- Connector connects to 0.91" I2C OLED display module.
- I2C OLED Connector
- ADC
- Calibration / Zeroing Switch
- Decoupling Cap for U2
- The inputs AIN2 & AIN3 were laid out to be
  able to measure the battery voltage so
  that the battery charge remaining could
  be displayed.
sheet 3
- Constant Current Sink
- 1.250 V
  Voltage Reference
- Decoupling Cap for U10
- Decoupling Cap for U3
- Unused Second OP AMP
  Part of Single OPA2365AIDR Package
- Current ranges and range selection
- Design Note
- Was planned to be used
  as active low-pass filter/buffer
  for ADC input.
- Total resistances at different ranges:
  1. 100Ω
  2. 720Ω
  3. 4.02kΩ
  4. 26.02kΩ
  5. 156.02kΩ
  6. 966.02kΩ
- Resistors are rated at 0.1%
- ON resistance of MAX4715 analog switch IC is 0.3Ω typical with a 3V supply
- These triple 270kΩ resistors were chosen during a parts
  shortage, as such, they have no special meaning besides
  equaling 810kΩ.
- Range 6 - Default Range
  Selected when no other range is enabled
sheet 4
- Battery, fuse, and ON - OFF Switch
- LDO 3.3V Voltage Regulator
- VBAT is the switched battery output voltage that gets distributed around the board
- Decoupling Cap for U9 Output
- 400 mA Fast Blow Fuse.
  Interrupt Rating:
  50A @125VAC/VDC
  300A @32VDC
- Decoupling Cap for U9 Input
- Battery Specifications:
  Type: Li-ion 18650
  Operating Voltage Range: 3.0V to 4.2V

# Board PCB1
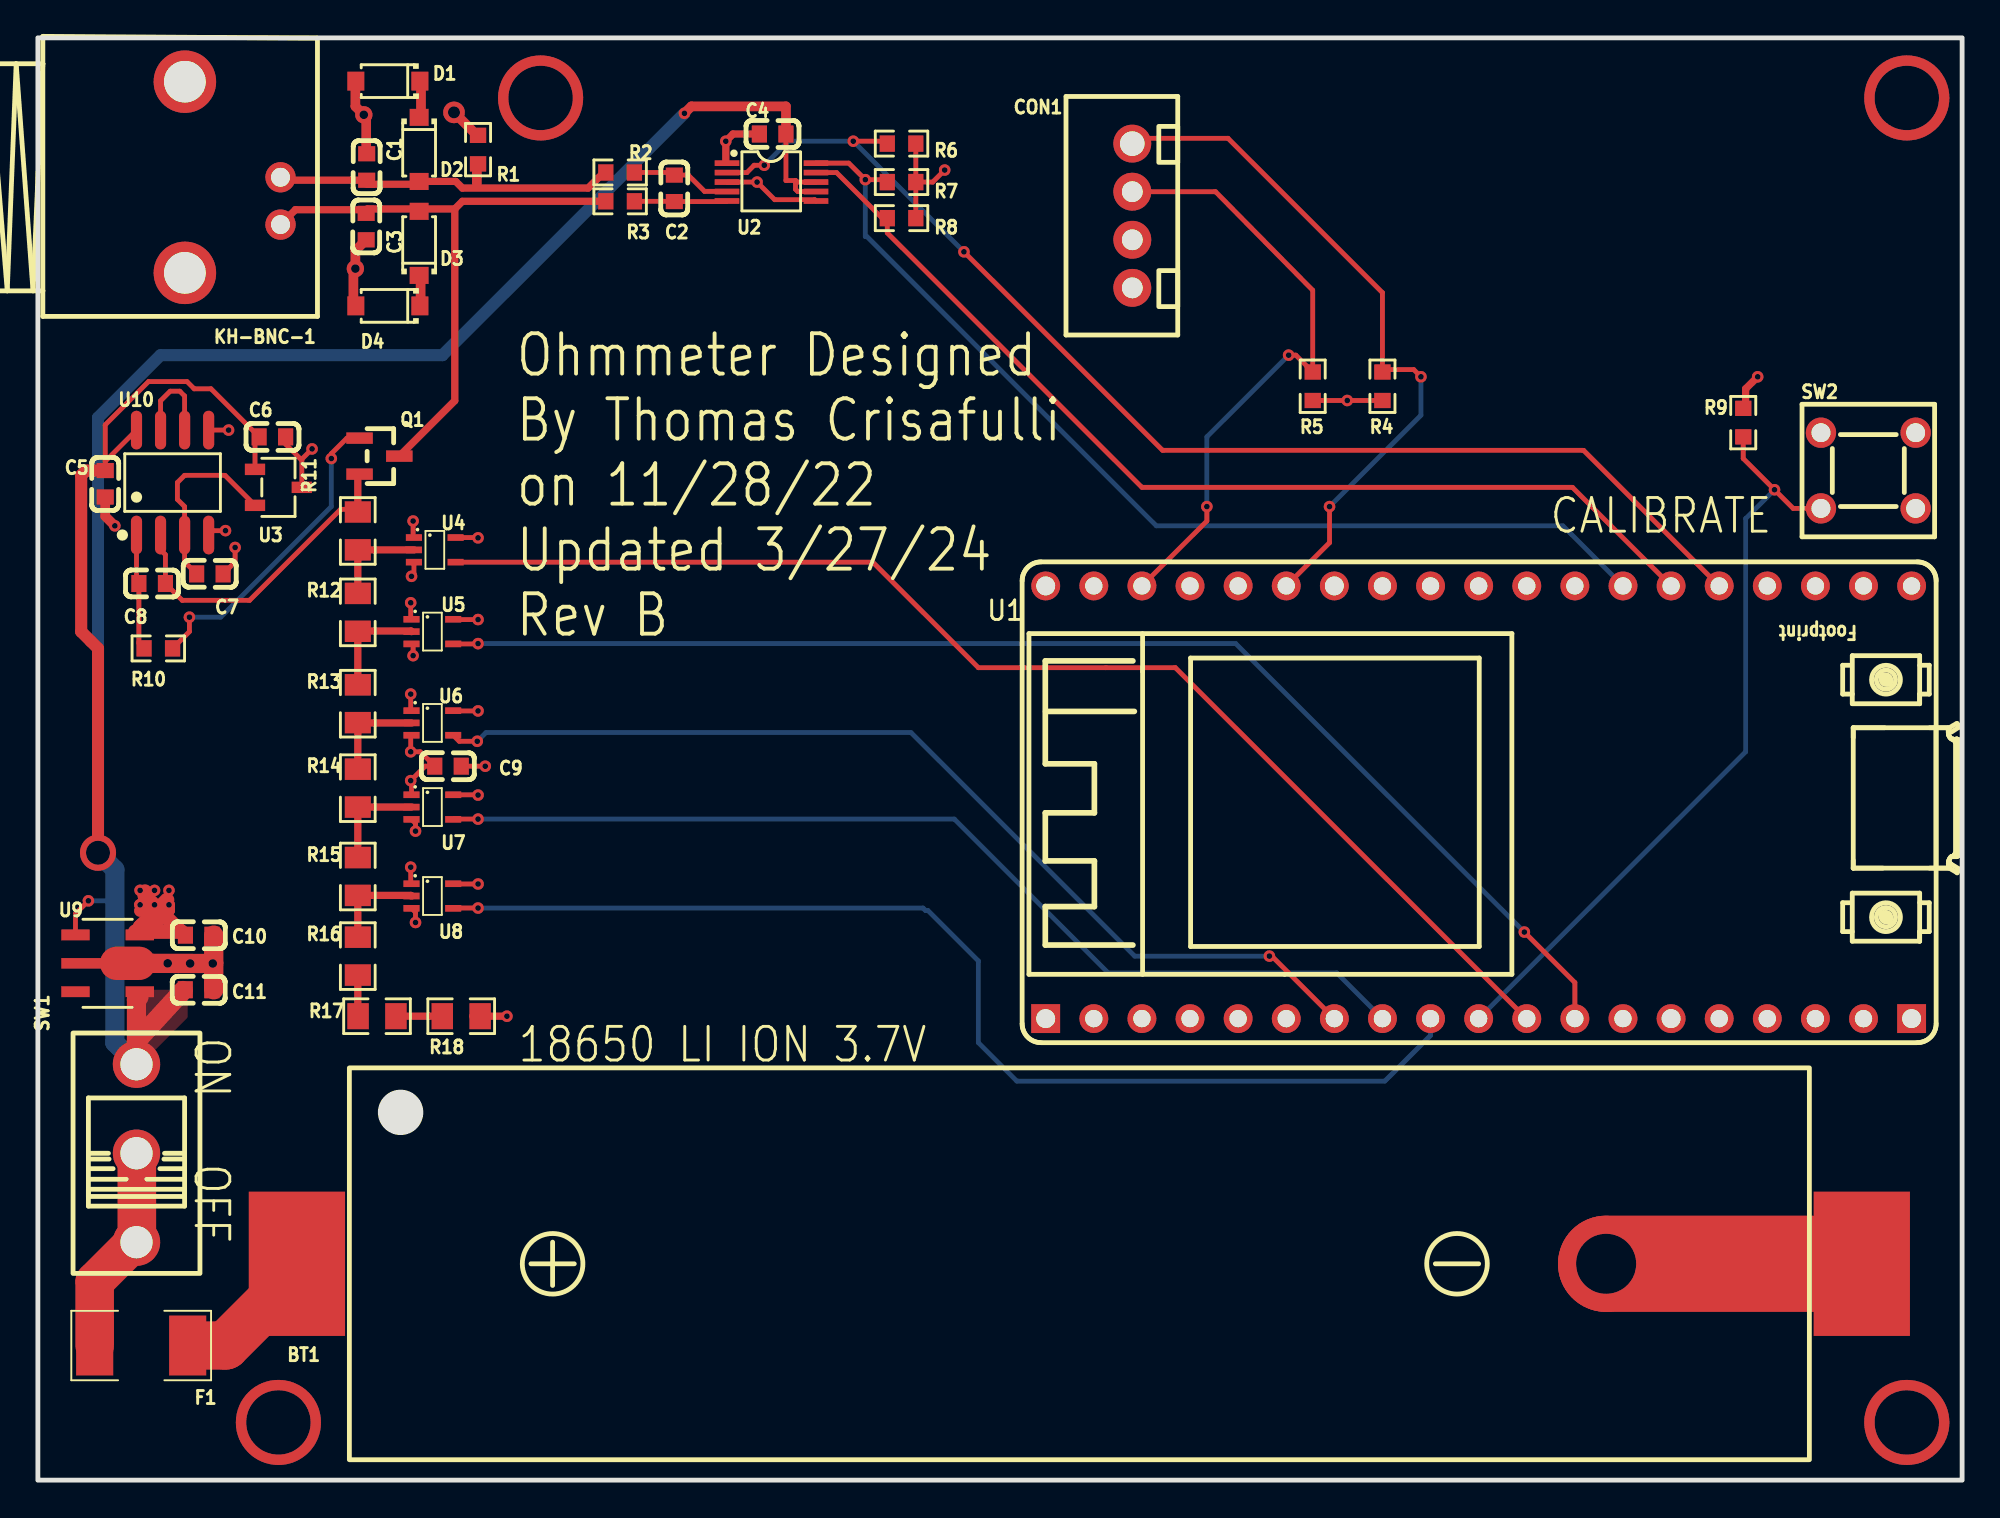
[diagram p4: board, top side]
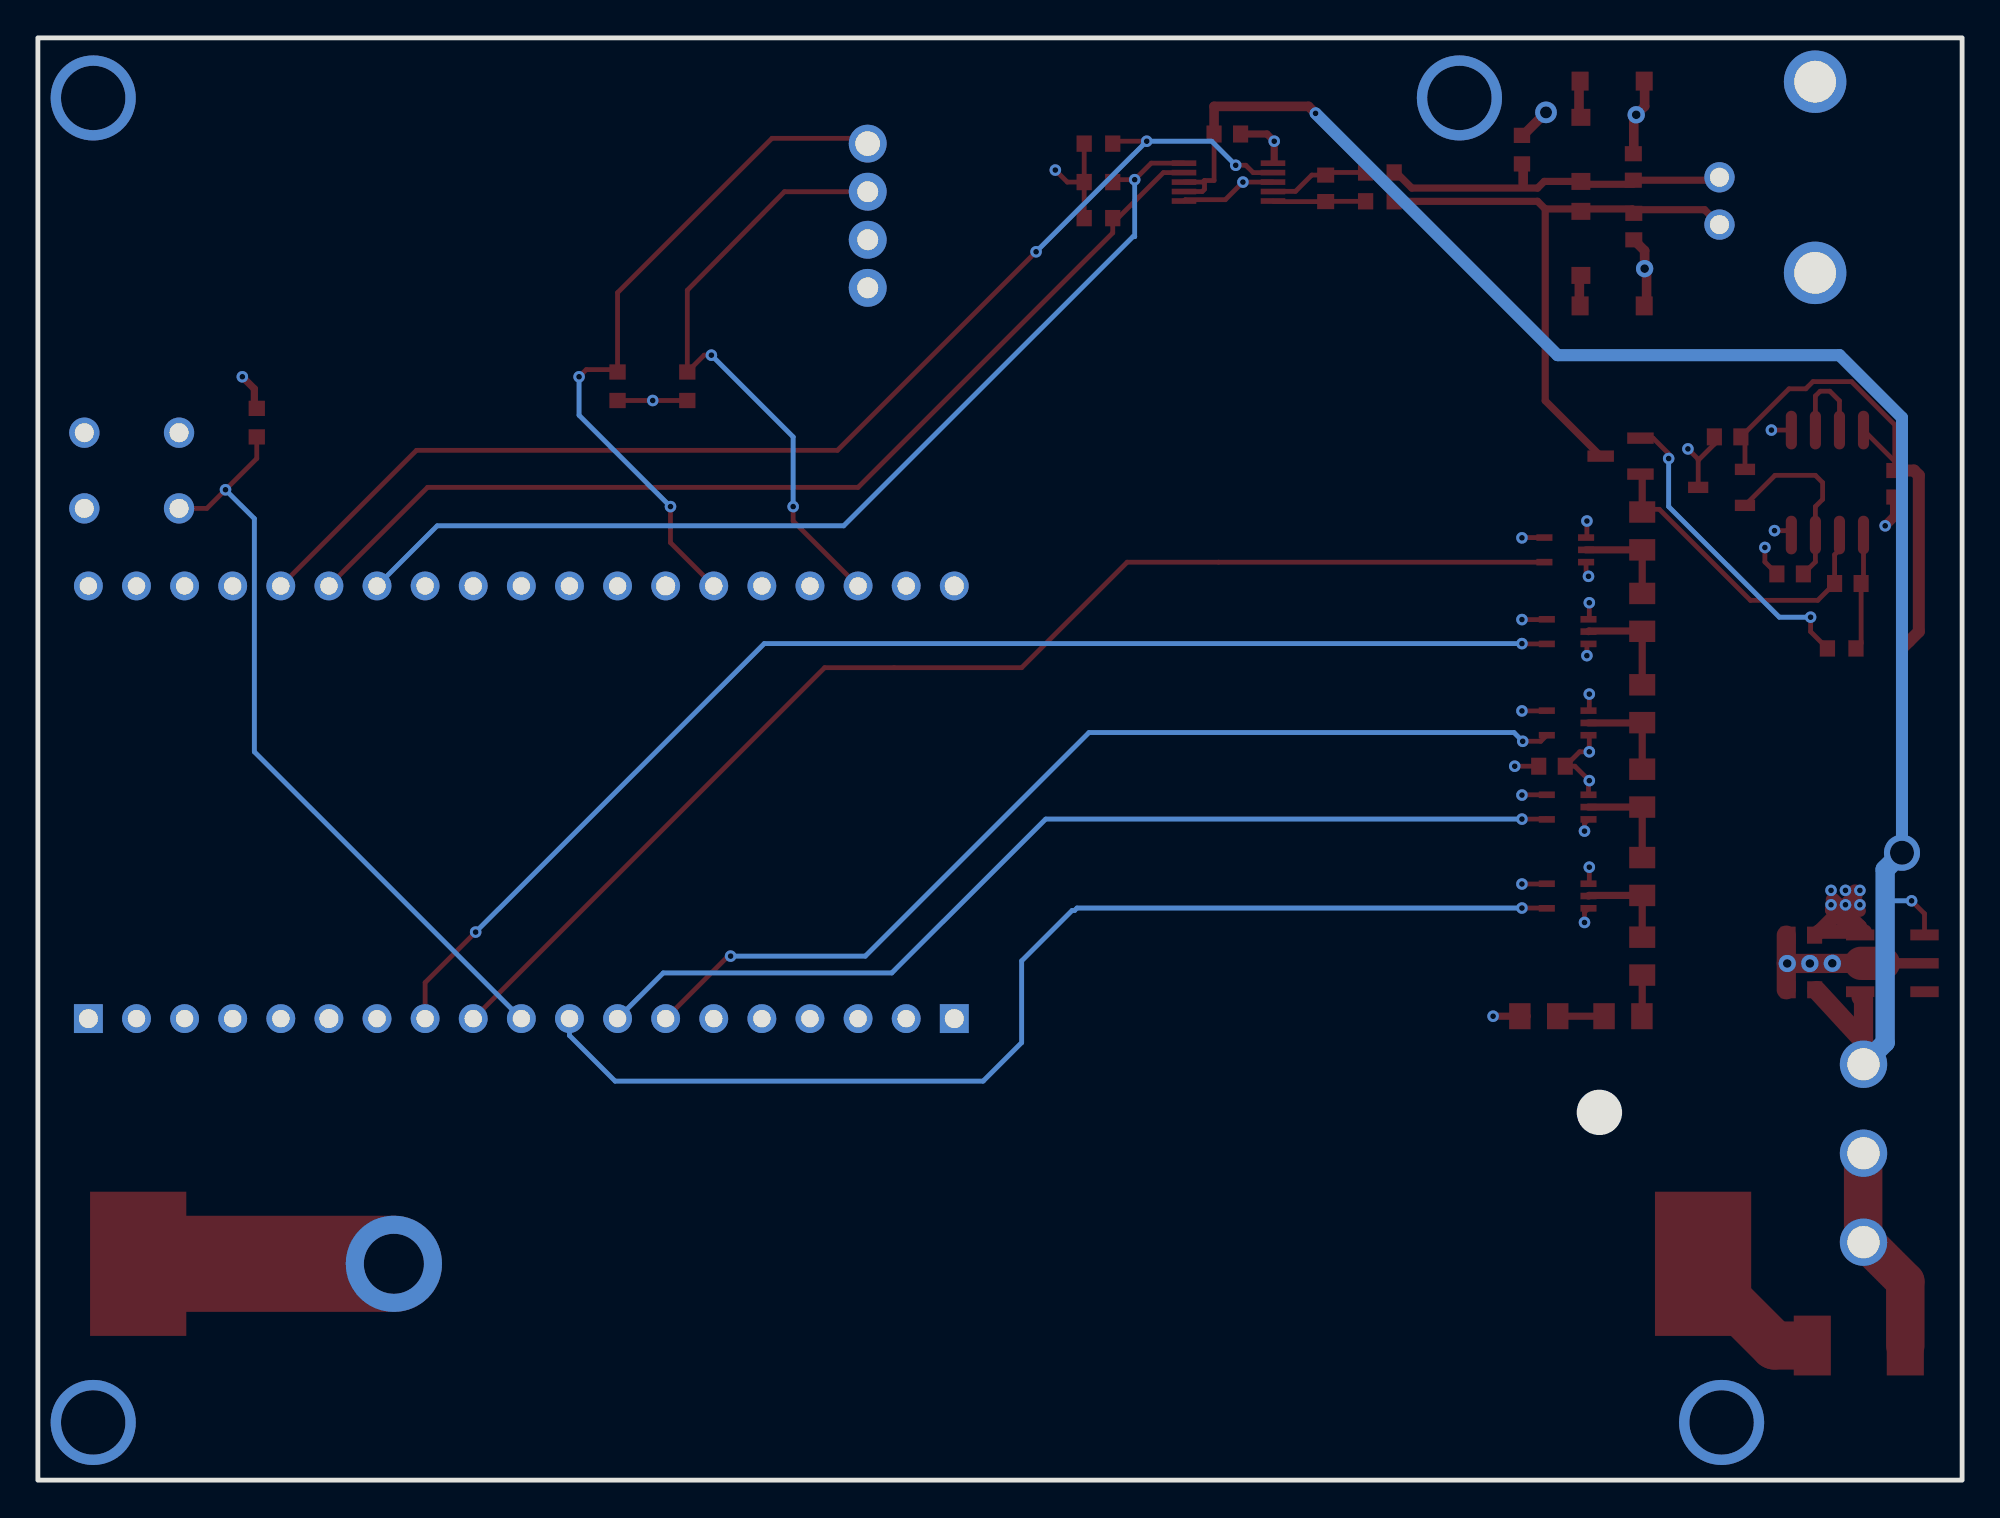
[diagram p5: board, bottom side, seen from below]

Outline 101.6 x 76.2 mm; copper layers: Top Layer, Inner1, Inner2, Bottom Layer. Coordinates in mm from the lower left corner of the outline.
Outline path: rectangle 0,76.2 101.6,0
Stack: Top Layer 0.035mm / Dielectric1 0.48mm PP er 4.5 / Inner1 0.035mm / Dielectric2 0.48mm FR4 er 4.5 / Inner2 0.035mm / Dielectric3 0.48mm PP er 4.5 / Bottom Layer 0.035mm

## Design rules (mm)
template: User Custom Config
spacing safeClearance (default): track to track 0.152, other pairs 0.152 to 0.3
track width trackWidth (default): min 0.127, default 0.254, max 5.08
differential pair differentialPair (default): width min 0.127, default 0.254, max 2.54; gap min 0.152, default 0.152
via viaSize (default): diameter min 0.5, default 0.61, max 10; hole min 0.3, default 0.305, max 5.999

## Placement (name value [footprint] x y rotation side)
BT1  BH-18650-B1BA002  [BATTERY-SMD_18650-1S-L77.1-W20.7-1]  54.99 11.43 90 top
C1  10nF  [C0603]  17.36 69.38 90 top
C2  100nF  [C0603]  33.6 68.25 90 top
C3  10nF  [C0603]  17.34 66.23 270 top
C4  100nF  [C0603]  38.8 71.12 0 top
C5  100nF  [C0603]  3.56 52.64 90 top
C6  10uF  [C0603]  12.38 55.12 180 top
C7  100nF  [C0603]  9.08 47.88 0 top
C8  100pF  [C0603]  6.03 47.37 0 top
C9  100nF  [C0603]  21.66 37.72 0 top
C10  10uF  [C0603]  8.49 28.79 180 top
C11  10uF  [C0603]  8.48 25.91 180 top
CON1  0.91" I2C OLED  XH2.54-4 Connector  [CONN-TH_XH2.54-4]  57.78 66.8 90 top
D1  PTVS30VS1UR,115  [SOD-123_L2.6-W1.7-LS3.5-RD]  18.48 73.91 180 top
D2  PTVS30VS1UR,115  [SOD-123_L2.6-W1.7-LS3.5-RD]  20.13 70.31 270 top
D3  PTVS30VS1UR,115  [SOD-123_L2.6-W1.7-LS3.5-RD]  20.13 65.34 90 top
D4  PTVS30VS1UR,115  [SOD-123_L2.6-W1.7-LS3.5-RD]  18.48 62.04 180 top
F1  -  [0451.400MRL]  8.89 7.11 180 top
KH-BNC-1  KH-BNC75-3511  [ANT-TH_KH-BNC75-3511]  10.29 68.83 270 top
Q1  BSH105,215  [TO-236AB_L2.9-W1.3-P0.95-LS2.3-BR]  18.03 54.1 180 top
R1  10Ω  [R0603]  23.24 70.29 90 top
R2  270Ω  [R0603]  30.74 69.09 0 top
R3  270Ω  [R0603]  30.74 67.56 0 top
R4  5.6kΩ  [R0603]  70.99 57.79 90 top
R5  5.6kΩ  [R0603]  67.31 57.79 270 top
R6  5.6kΩ  [R0603]  45.6 70.61 0 top
R7  5.6kΩ  [R0603]  45.6 68.58 0 top
R8  5.6kΩ  [R0603]  45.6 66.67 0 top
R9  5.6kΩ  [R0603]  90.04 55.87 90 top
R10  5.6kΩ  [R0603]  6.36 43.94 180 top
R11  100Ω  [R0805]  16.89 50.15 90 top
R12  620Ω  [R0805]  16.89 45.85 90 top
R13  3.3kΩ  [R0805]  16.89 41.02 90 top
R14  22kΩ  [R0805]  16.89 36.56 90 top
R15  130kΩ  [R0805]  16.89 31.89 90 top
R16  270kΩ  [R0805]  16.89 27.69 90 top
R17  270kΩ  [R0805]  17.91 24.51 180 top
R18  270kΩ  [R0805]  22.35 24.51 180 top
SW1  SS-12D10L4  [SW-TH_SS-12D10L3]  5.21 17.27 90 top
SW2  BTSA-N-P-11  [SW-TH_BTSA-X-P-11]  96.65 53.34 0 top
U1  ESP32  [NODEMCU-32SLUA]  76.07 35.81 90 top
U2  ADS1115IDGST  [VSSOP-10_L3.0-W3.0-P0.50-LS4.9-BL]  38.74 68.58 270 top
U3  REF3112AIDBZR  [SOT-23-3_L2.9-W1.6-P1.90-LS2.8-BR]  12.7 52.45 180 top
U4  MAX4715EXK+T  [SC-70-5_L2.0-W1.3-P0.65-LS2.1-BR]  20.95 49.15 180 top
U5  MAX4715EXK+T  [SC-70-5_L2.0-W1.3-P0.65-LS2.1-BR]  20.83 44.83 180 top
U6  MAX4715EXK+T  [SC-70-5_L2.0-W1.3-P0.65-LS2.1-BR]  20.83 40 180 top
U7  MAX4715EXK+T  [SC-70-5_L2.0-W1.3-P0.65-LS2.1-BR]  20.83 35.56 180 top
U8  MAX4715EXK+T  [SC-70-5_L2.0-W1.3-P0.65-LS2.1-BR]  20.83 30.86 180 top
U9  ME6217C33P5G  [SOT-89-5_L4.5-W2.5-P1.50-LS4.5-BR]  3.68 27.3 180 top
U10  OPA2365AIDR  [SOIC-8_L4.9-W3.9-P1.27-LS6.0-BL]  7.11 52.7 0 top

## Footprints (pads in the part's own frame, mm; a bottom-side part is the same pattern mirrored in y, then rotated)
0451.400MRL
  custom 1.96x3.16 smd: 1(0.98,0) 2(5.89,0)
ANT-TH_KH-BNC75-3511
  round 1.6 hole 1: 1(0,2.525) 2(2.5,2.525)
  round 3.3 hole 2.2: 3(5.05,-2.525) 4(-5.05,-2.525)
BATTERY-SMD_18650-1S-L77.1-W20.7-1
  rect 7.62x5.08 smd: 1(0,-41.313) 2(0,41.313)
C0603
  rect 0.8x0.9 smd: 1(-0.7,0) 2(0.7,0)
CONN-TH_XH2.54-4
  round 2 hole 1.1: 1(-3.81,0) 2(-1.27,0) 3(1.27,0)
  round 2 hole 1.3: 4(3.81,0)
NODEMCU-32SLUA
  rect 1.524x1.524 hole 1: 1(-11.43,-22.86) 19(-11.43,22.86)
  round 1.524 hole 0.914: 2(-11.43,-20.32) 3(-11.43,-17.78) 4(-11.43,-15.24) 5(-11.43,-12.7) 7(-11.43,-7.62) 8(-11.43,-5.08) 9(-11.43,-2.54) 10(-11.43,0) 11(-11.43,2.54) 12(-11.43,5.08) 13(-11.43,7.62) 14(-11.43,10.16) 15(-11.43,12.7) 16(-11.43,15.24) 17(-11.43,17.78) 18(-11.43,20.32) 20(11.43,-22.86) 21(11.43,-20.32) 22(11.43,-17.78) 23(11.43,-15.24) 24(11.43,-12.7) 25(11.43,-10.16) 26(11.43,-7.62) 27(11.43,-5.08) 28(11.43,-2.54) 29(11.43,0) 30(11.43,2.54) 31(11.43,5.08) 33(11.43,10.16) 34(11.43,12.7) 35(11.43,15.24) 36(11.43,17.78) 37(11.43,20.32)
  round 1.524 hole 1: 6(-11.43,-10.16) 32(11.43,7.62) 38(11.43,22.86)
R0603
  rect 0.806x0.864 smd: 1(-0.753,0) 2(0.753,0)
R0805
  rect 1.133x1.377 smd: 1(-1,0) 2(1,0)
SC-70-5_L2.0-W1.3-P0.65-LS2.1-BR
  rect 0.85x0.35 smd: 1(1.1,-0.65) 2(1.1,0) 3(1.1,0.65) 4(-1.1,0.65) 5(-1.1,-0.65)
SOD-123_L2.6-W1.7-LS3.5-RD
  rect 0.9x1 smd: 1(-1.692,0) 2(1.692,0)
SOIC-8_L4.9-W3.9-P1.27-LS6.0-BL
  oval 0.588x2.045 smd: 1(-1.905,-2.772) 2(-0.635,-2.772) 3(0.635,-2.772) 4(1.905,-2.772) 5(1.905,2.772) 6(0.635,2.772) 7(-0.635,2.772) 8(-1.905,2.772)
SOT-23-3_L2.9-W1.6-P1.90-LS2.8-BR
  rect 1.07x0.6 smd: 1(1.235,-0.95) 2(1.235,0.95) 3(-1.235,0)
SOT-89-5_L4.5-W2.5-P1.50-LS4.5-BR
  rect 1.5x0.574 smd: 1(1.698,-1.5) 3(1.698,1.5) 4(-1.698,1.5) 5(-1.698,-1.5)
  oval 2.94x1.76 smd: 2(-1.067,0)
  rect 2.209x0.552 smd: 2(1.343,0)
SW-TH_BTSA-X-P-11
  round 1.6 hole 1: 1(-2.5,2) 2(-2.5,-2) 3(2.5,2) 4(2.5,-2)
SW-TH_SS-12D10L3
  round 2.5 hole 1.7: 1(-4.7,0) 2(0,0) 3(4.7,0)
TO-236AB_L2.9-W1.3-P0.95-LS2.3-BR
  rect 1.4x0.6 smd: 1(1.05,-0.95) 2(1.05,0.95) 3(-1.05,0)
VSSOP-10_L3.0-W3.0-P0.50-LS4.9-BL
  rect 0.3x1.3 smd: 1(-1,-2.35) 2(-0.5,-2.35) 3(0,-2.35) 4(0.5,-2.35) 5(1,-2.35) 6(1,2.35) 7(0.5,2.35) 8(0,2.35) 9(-0.5,2.35) 10(-1,2.35)

## Nets
As in the schematic.

Pads without a net: KH-BNC-1 3 4; SW2 3 4; U1 1 2 3 4 5 7 14 15 16 17 18 20 21 22 23 27 28 29 30 31 34 35 37; U9 3

## Via types
v1: diameter 4.496, hole 3.404, Top Layer to Bottom Layer, 4 vias
v2: diameter 0.61, hole 0.305, Top Layer to Bottom Layer, 52 vias
v3: diameter 5.08, hole 3.175, Top Layer to Bottom Layer, 1 via
v4: diameter 0.914, hole 0.457, Top Layer to Bottom Layer, 5 vias
v5: diameter 1.905, hole 1.27, Top Layer to Bottom Layer, 1 via
v6: diameter 1.143, hole 0.635, Top Layer to Bottom Layer, 1 via

## Routing (per net, layer and track width the routed paths; a pad name or vN(x,y) marks a point on that pad's centre or on a via; arc(x,y) is an arc through that point)
1.250V: length 10.2
  Top Layer w0.254: U3.2 9.88,53.09 7.75,53.09 7.37,52.7 7.37,51.82 7.75,51.43 U10.3 7.75,48.51 C7.1
3V3: length 31.7
  Top Layer w0.254: U7.5 23.23,36.21 v2(23.24,36.19) ; v2(23.24,49.78) 23.23,49.8 22.06,49.8 ; v2(23.24,40.64) 21.94,40.64 U6.5 ; v2(23.24,31.5) 21.94,31.5 U8.5 ; v2(23.24,45.47) 21.94,45.47 U5.5 ; R7.2 47.24,68.58 v2(47.88,69.21) ; R7.2 R8.2 ; R7.2 R6.2 ; R5.2 v2(69.13,57.04) R4.1 ; v2(23.62,37.72) C9.2
  Top Layer w0.381: R9.2 90.17,56.75 90.17,57.66 v2(90.81,58.29)
  Top Layer w0.508: 21.88,72.36 23.18,71.06 23.18,70.94
  Top Layer w0.635: v2(6.16,30.4) 5.84,30.4 5.78,30.46 5.72,30.4 ; 5.72,30.4 5.4,30.08 ; 5.72,30.4 v2(5.4,30.4) ; 6.08,29.27 6.92,30.11 v2(6.92,30.4)
  Top Layer w0.762: 5.15,28.98 7.58,28.98 ; 6.82,30.65 5.4,29.24 5.4,28.94 ; 5.65,31.1 5.65,30.87 7.73,28.79
  vias: v2(5.4,31.16) v2(6.16,31.16) v2(6.92,31.16) v6(21.97,72.26)
GND: length 58.9
  Top Layer w0.254: U4.3 19.86,47.88 v2(19.73,47.75) ; C6.1 13.08,54.74 13.94,53.88 ; U7.1 19.73,36.91 v2(19.69,36.96) 20.45,37.72 C9.1 20.19,38.48 v2(19.69,38.48) 19.69,39.31 U6.3 ; v2(10.07,55.48) U10.5 ; U7.3 19.94,34.7 v2(19.94,34.29) ; U5.3 19.81,44.1 v2(19.81,43.56) ; 13.94,53.88 U3.3 ; 13.94,53.88 13.94,53.94 v2(14.48,54.48) ; v2(19.81,50.67) 19.81,49.84 U4.1 ; U6.1 19.69,40.7 v2(19.69,41.53) ; v2(10.41,49.28) 10.41,48.51 C7.2 ; U10.4 9.25,50.16 v2(9.91,50.16) ; U5.1 19.69,45.52 v2(19.69,46.35) ; U8.3 19.94,30 v2(19.94,29.46) ; 36.38,68.58 v2(37.97,68.58) 38.9,67.65 41.01,67.65 U2.6 ; v2(19.69,32.38) 19.69,31.55 U8.1
  Top Layer w0.381: v2(24.77,24.51) 22.95,24.51 ; C4.1 36.7,71.12 v2(36.32,70.74) 36.32,69.64
  Top Layer w0.508: C5.1 3.56,50.93 v2(4.06,50.42) ; 16.91,73.91 16.76,73.76 16.76,72.58 17.34,72.01 17.34,70 17.36,69.98 ; 16.66,61.98 16.66,63.9 v4(16.76,64.01) 16.76,64.96 C3.2
  Top Layer w1.016: 4.92,27.3 v4(9.23,27.3) ; 9.28,28.79 9.28,27.3 9.28,25.91
  Top Layer w5.08: v3(82.8,11.43) 95.8,11.43
  vias: v4(6.85,27.31) v4(8.04,27.3) v4(17.21,72.14)
VBAT: length 135.7
  Top Layer w0.254: U9.1 1.99,29.93 v2(2.67,30.61) ; 3.56,53.83 C5.2 ; 3.56,53.83 3.56,55.75 5.84,58.04 7.87,58.04 8.25,57.66 9.14,57.66 C6.2 11.47,54.9 U3.1 ; 3.56,53.83 U10.8 ; 40.09,68.58 40,68.66 ; 40.09,68.58 40,68.58 ; 40.09,68.58 U2.8 ; 40,68.66 40,68.58 ; 40,68.66 39.5,68.66 C4.2 ; 40,68.58 40,68.2 40.12,68.08 U2.7
  Top Layer w0.508: v2(34.14,72.21) 34.51,72.58 39.5,72.58 39.5,71.31 39.43,71.25
  Top Layer w0.635: C5.2 2.54,53.34 2.29,53.09 2.29,44.83 3.17,43.94 v5(3.17,33.15)
  Top Layer w1.016: 5.33,25.53 5.21,25.4 SW1.3 5.21,23.19 7.67,25.87
  Bottom Layer w0.254: v2(2.67,30.61) 4.06,30.61
  Bottom Layer w0.635: v5(3.17,33.15) 3.17,56.13 6.48,59.44 21.36,59.44 v2(34.14,72.21)
  Bottom Layer w1.016: v5(3.17,33.15) 4.06,32.26 4.06,23.11 SW1.3
(no net):
  vias: v1(12.7,3.05) v1(26.54,73.02) v1(98.68,73.02) v1(98.68,3.05)
ADC_I2C_ALERT_RDY: length 64.7
  Top Layer w0.254: v2(48.9,64.9) 59.38,54.41 81.61,54.41 U1.24 ; v2(38.35,69.47) 37.82,69.47 37.43,69.08 36.38,69.08 ; R6.1 44.72,70.74 v2(43.05,70.74)
  Bottom Layer w0.254: v2(48.9,64.9) v2(43.05,70.74) 39.62,70.74 v2(38.35,69.47)
ADC_I2C_SCL: length 54.8
  Top Layer w0.254: R7.1 44.72,68.71 v2(43.69,68.71) 42.81,69.58 U2.10
  Bottom Layer w0.254: U1.26 80.52,50.42 59.06,50.42 43.78,65.7 43.69,65.7 v2(43.69,68.71)
ADC_I2C_SDA: length 54.6
  Top Layer w0.254: U2.9 42.17,69.08 44.58,66.67 R8.1 44.85,65.9 58.29,52.45 81.03,52.45 U1.25
CALIBRATE: length 40.7
  Top Layer w0.254: SW2.2 92.68,51.34 v2(91.69,52.32) 90.04,53.97 R9.1
  Bottom Layer w0.254: v2(91.69,52.32) 90.17,50.8 90.17,38.48 U1.10
CURRENT_SINK_IN: length 31.6
  Top Layer w0.381: 17.4,67.16 17.4,67.16 22.01,67.16 ; Q1.3 22.01,57.03 22.01,67.16 ; 22.01,67.16 22.42,67.56 29.99,67.56 ; 17.02,67.12 13.6,67.12 KH-BNC-1.2
OLED_I2C_SCL: length 33.1
  Top Layer w0.254: v2(61.72,51.43) 61.72,50.67 U1.36 ; v2(66.04,59.44) 66.42,59.44 R5.1 67.31,62.86 62.18,68.07 CON1.3
  Bottom Layer w0.254: v2(66.04,59.44) 61.72,55.12 v2(61.72,51.43)
OLED_I2C_SDA: length 37.1
  Top Layer w0.254: v2(68.2,51.43) 68.2,49.53 U1.33 ; v2(73.03,58.29) 72.64,58.67 71.12,58.67 R4.2 70.99,62.74 62.84,70.89 58.06,70.89 CON1.4
  Bottom Layer w0.254: v2(73.03,58.29) 73.03,56.26 v2(68.2,51.43)
RANGE_SW_1: length 66.5
  Top Layer w0.254: U1.9 78.6,24.38 60.06,42.93 49.66,42.93 44.08,48.5 22.06,48.5
RANGE_SW_2: length 68.6
  Top Layer w0.254: 81.15,24.38 81.15,26.29 v2(78.49,28.96) ; U5.4 23.23,44.18 v2(23.24,44.2)
  Bottom Layer w0.254: v2(78.49,28.96) 63.25,44.2 v2(23.24,44.2)
RANGE_SW_3: length 53.1
  Top Layer w0.254: v2(65.02,27.69) 65.15,27.69 U1.13 ; U6.4 22.25,39.04 v2(23.2,39.04)
  Bottom Layer w0.254: v2(23.2,39.04) 23.66,39.5 46.1,39.5 57.91,27.69 v2(65.02,27.69)
RANGE_SW_4: length 53.4
  Top Layer w0.254: U7.4 21.94,34.92 v2(23.24,34.92)
  Bottom Layer w0.254: U1.12 68.58,26.8 56.51,26.8 48.39,34.92 v2(23.24,34.92)
RANGE_SW_5: length 59.8
  Top Layer w0.254: v2(23.24,30.23) 21.94,30.23 U8.4
  Bottom Layer w0.254: 73.53,24.38 73.53,23.49 71.12,21.08 51.69,21.08 49.66,23.11 49.66,27.43 46.99,30.1 46.86,30.1 46.74,30.23 v2(23.24,30.23)
$1N34949: length 1.7
  Top Layer w0.508: 20.26,72.3 20.23,72.33 20.23,73.84 20.3,73.91
$1N40044: length 1.8
  Top Layer w0.508: 20.13,63.71 20.21,63.63 20.21,62.14 20.04,61.98
$1N64285: length 18.7
  Top Layer w0.381: 20.13,68.46 17.36,68.46 ; D2.2 22.06,68.61 22.42,68.26 29.05,68.26 29.91,69.12 ; KH-BNC-1.1 12.97,68.68 C1.1
  Top Layer w0.508: 23.18,69.54 23.18,68.5
$4N526: length 16.6
  Top Layer w0.254: R10.1 8,44.83 v2(8,45.59) ; Q1.1 16.32,55.05 15.49,54.23 v2(15.49,53.97)
  Bottom Layer w0.254: v2(8,45.59) 9.65,45.59 15.49,51.43 v2(15.49,53.97)
$4N529: length 6.2
  Top Layer w0.254: 5.61,43.94 5.33,44.21 C8.1 5.21,47.5 U10.1
$4N533: length 4.9
  Top Layer w0.254: U10.7 6.48,57.02 6.98,57.53 7.49,57.53 7.75,57.28 U10.6
$4N538: length 17.3
  Top Layer w0.254: U10.2 6.48,49.15 6.73,48.89 C8.2 7.62,46.48 11.18,46.48 15.98,51.29 16.75,51.29 R11.2
  Top Layer w0.381: Q1.2 16.89,53.06 R11.2
$4N2972: length 4.8
  Top Layer w0.381: 16.89,28.96 R15.1 19.7,30.89 U8.2
$4N2973: length 5.3
  Top Layer w0.381: R14.2 16.89,40 U6.2
$4N2979: length 5.5
  Top Layer w0.381: R15.2 R14.1 U7.2
$4N2983: length 5.7
  Top Layer w0.381: 16.89,42 16.89,44.86 19.7,44.86 U5.2
$4N3047: length 5.2
  Top Layer w0.381: 16.89,46.86 R11.1 U4.2
ADC_AIN0: length 5.3
  Top Layer w0.254: 31.54,69.09 33.47,69.09 C2.2 34.34,68.95 35.2,68.09 36.38,68.09 36.38,68.08
ADC_AIN1: length 4.9
  Top Layer w0.254: 31.54,67.56 33.59,67.56 C2.1 36.35,67.55 36.38,67.58
$4N2969: length 2.2
  Top Layer w0.381: 16.89,26.61 16.89,24.64 17.02,24.51
$4N2970: length 2.2
  Top Layer w0.381: 19.11,24.51 R18.2
$6N1642: length 4.7
  Top Layer w2.54: 8.29,7.11 9.91,7.11 12.06,9.27
$6N1643: length 11.1
  Top Layer w2.032: F1.2 3,10.49 5.23,12.72 5.23,17.25

## Copper pours and planes (outline as drawn; the poured copper is in the pictures)
3V3 on Top Layer: 7.37,28.9 4.95,28.9 4.95,31.73 7.37,31.73
3V3 on Inner2: 0.26,75.94 101.34,75.94 101.34,0.26 0.26,0.26
GND on Top Layer: 82.8,13.97 95,13.97 95,8.89 82.8,8.89
GND on Inner1: 0.26,75.94 101.34,75.94 101.34,0.26 0.26,0.26
VBAT on Top Layer: 4.95,25.9 7.91,25.9 7.91,22.26 4.95,22.26
VBAT on Top Layer: 4.83,25.91 7.92,25.91 7.92,22.81 4.83,22.81

Small or netless copper shapes (teardrops, artwork), in the pictures only: 19 on Inner1, 6 on Inner2

## Text on the board
Top Silkscreen Layer: Footprint | 18650 LI ION 3.7V | ON   OFF | CALIBRATE | Ohmmeter Designed / By Thomas Crisafulli / on 11/28/22 / Updated 3/27/24 / Rev B
